# EAGLE board haasoscope_pro_adc_fpga_board (EAGLE 9.6.2), part 1 of 4
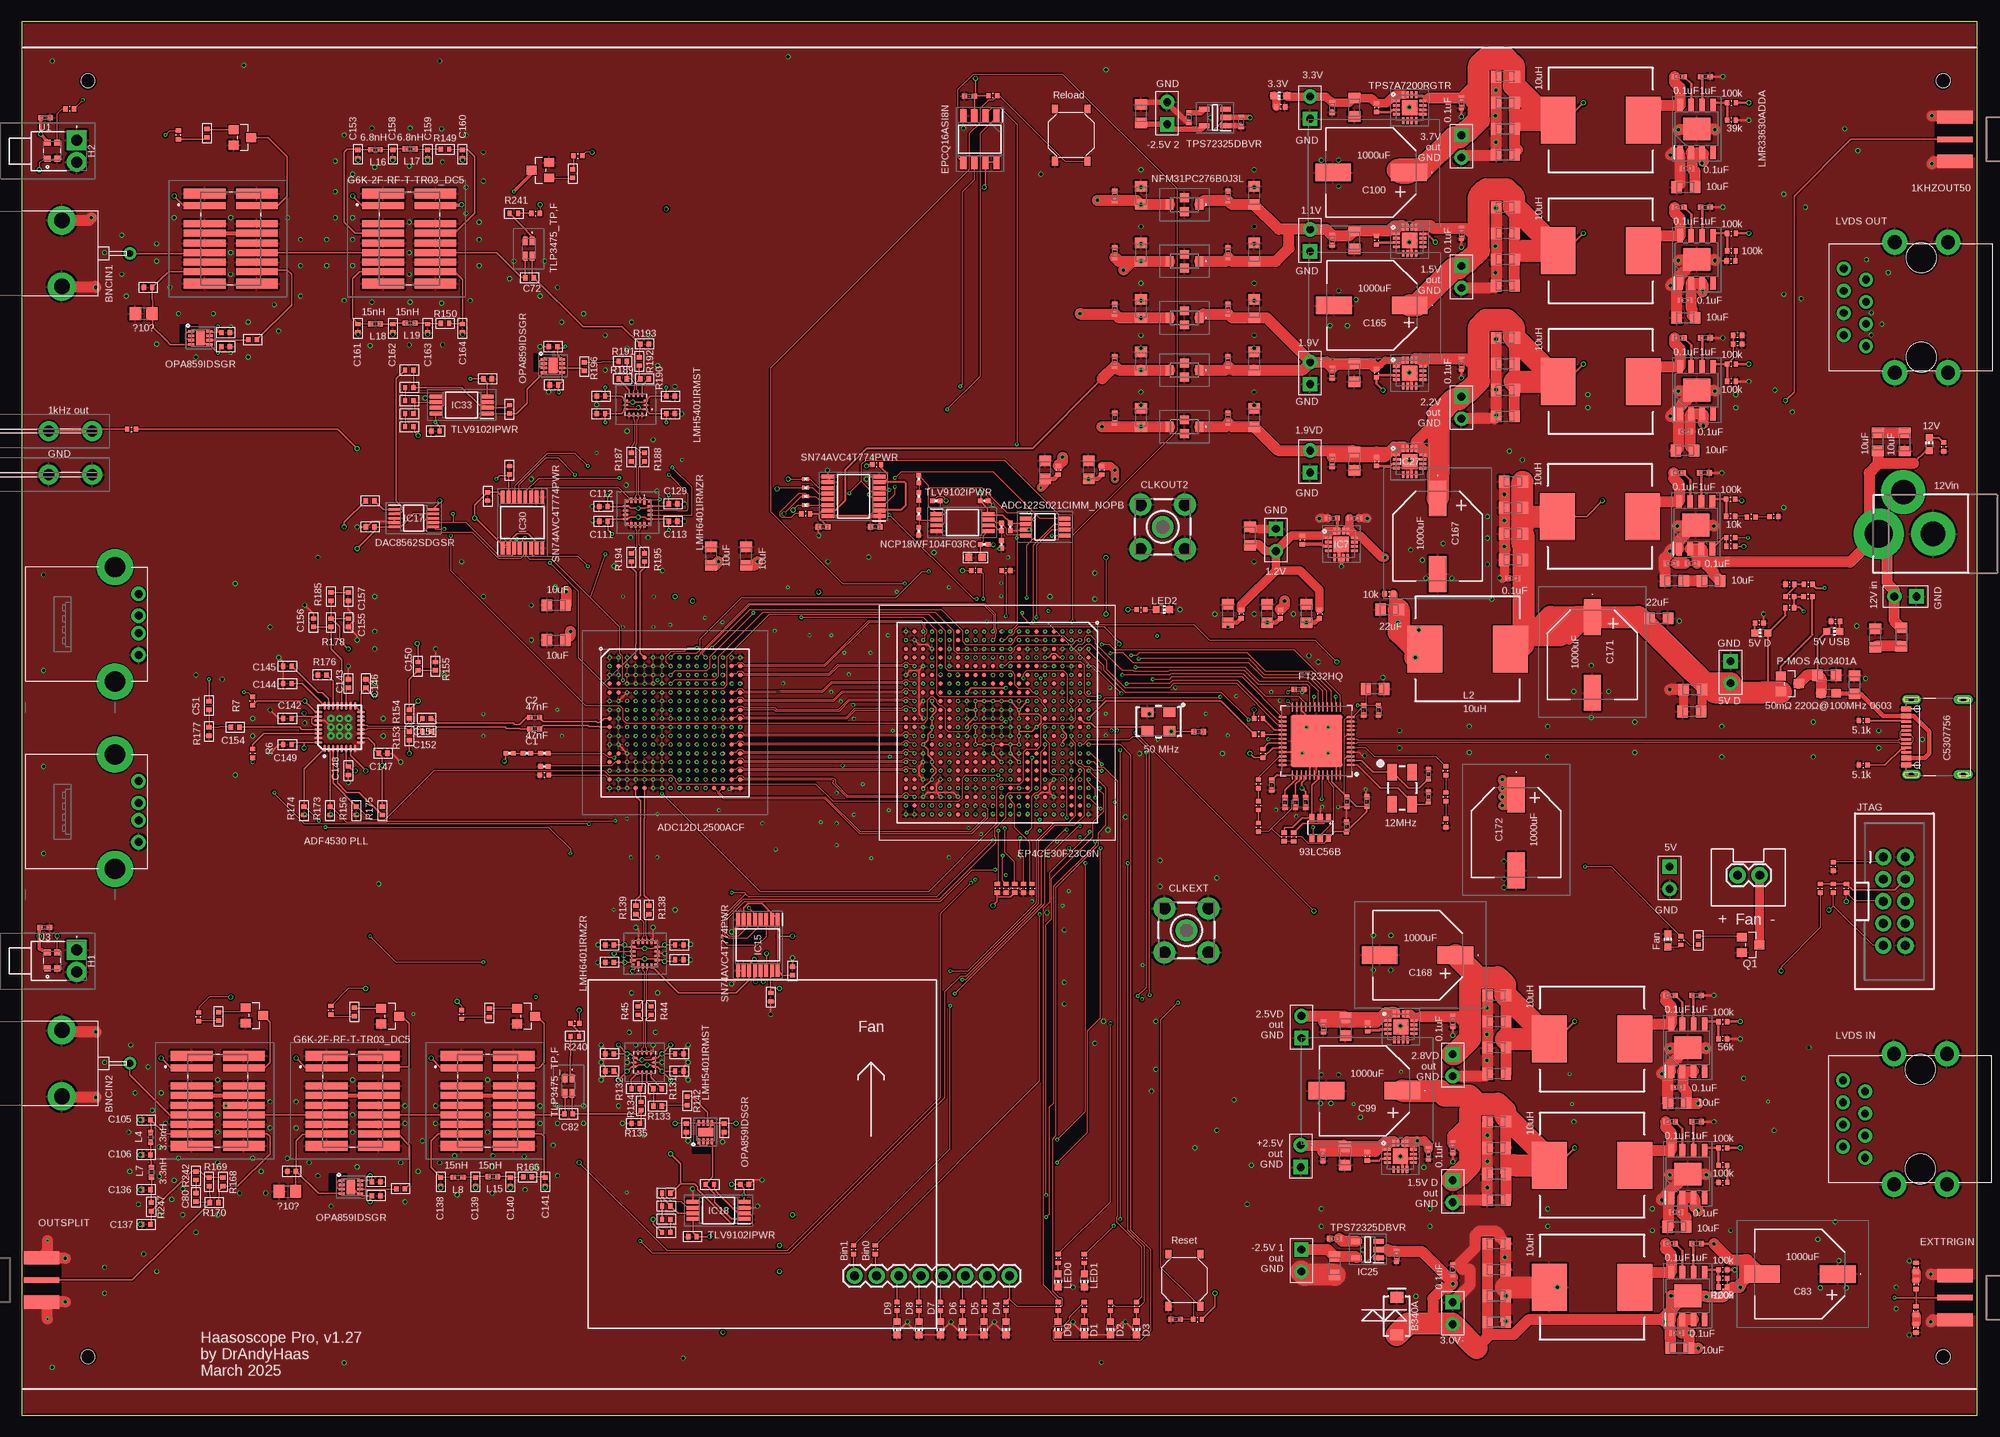
[diagram p16: board, top side]
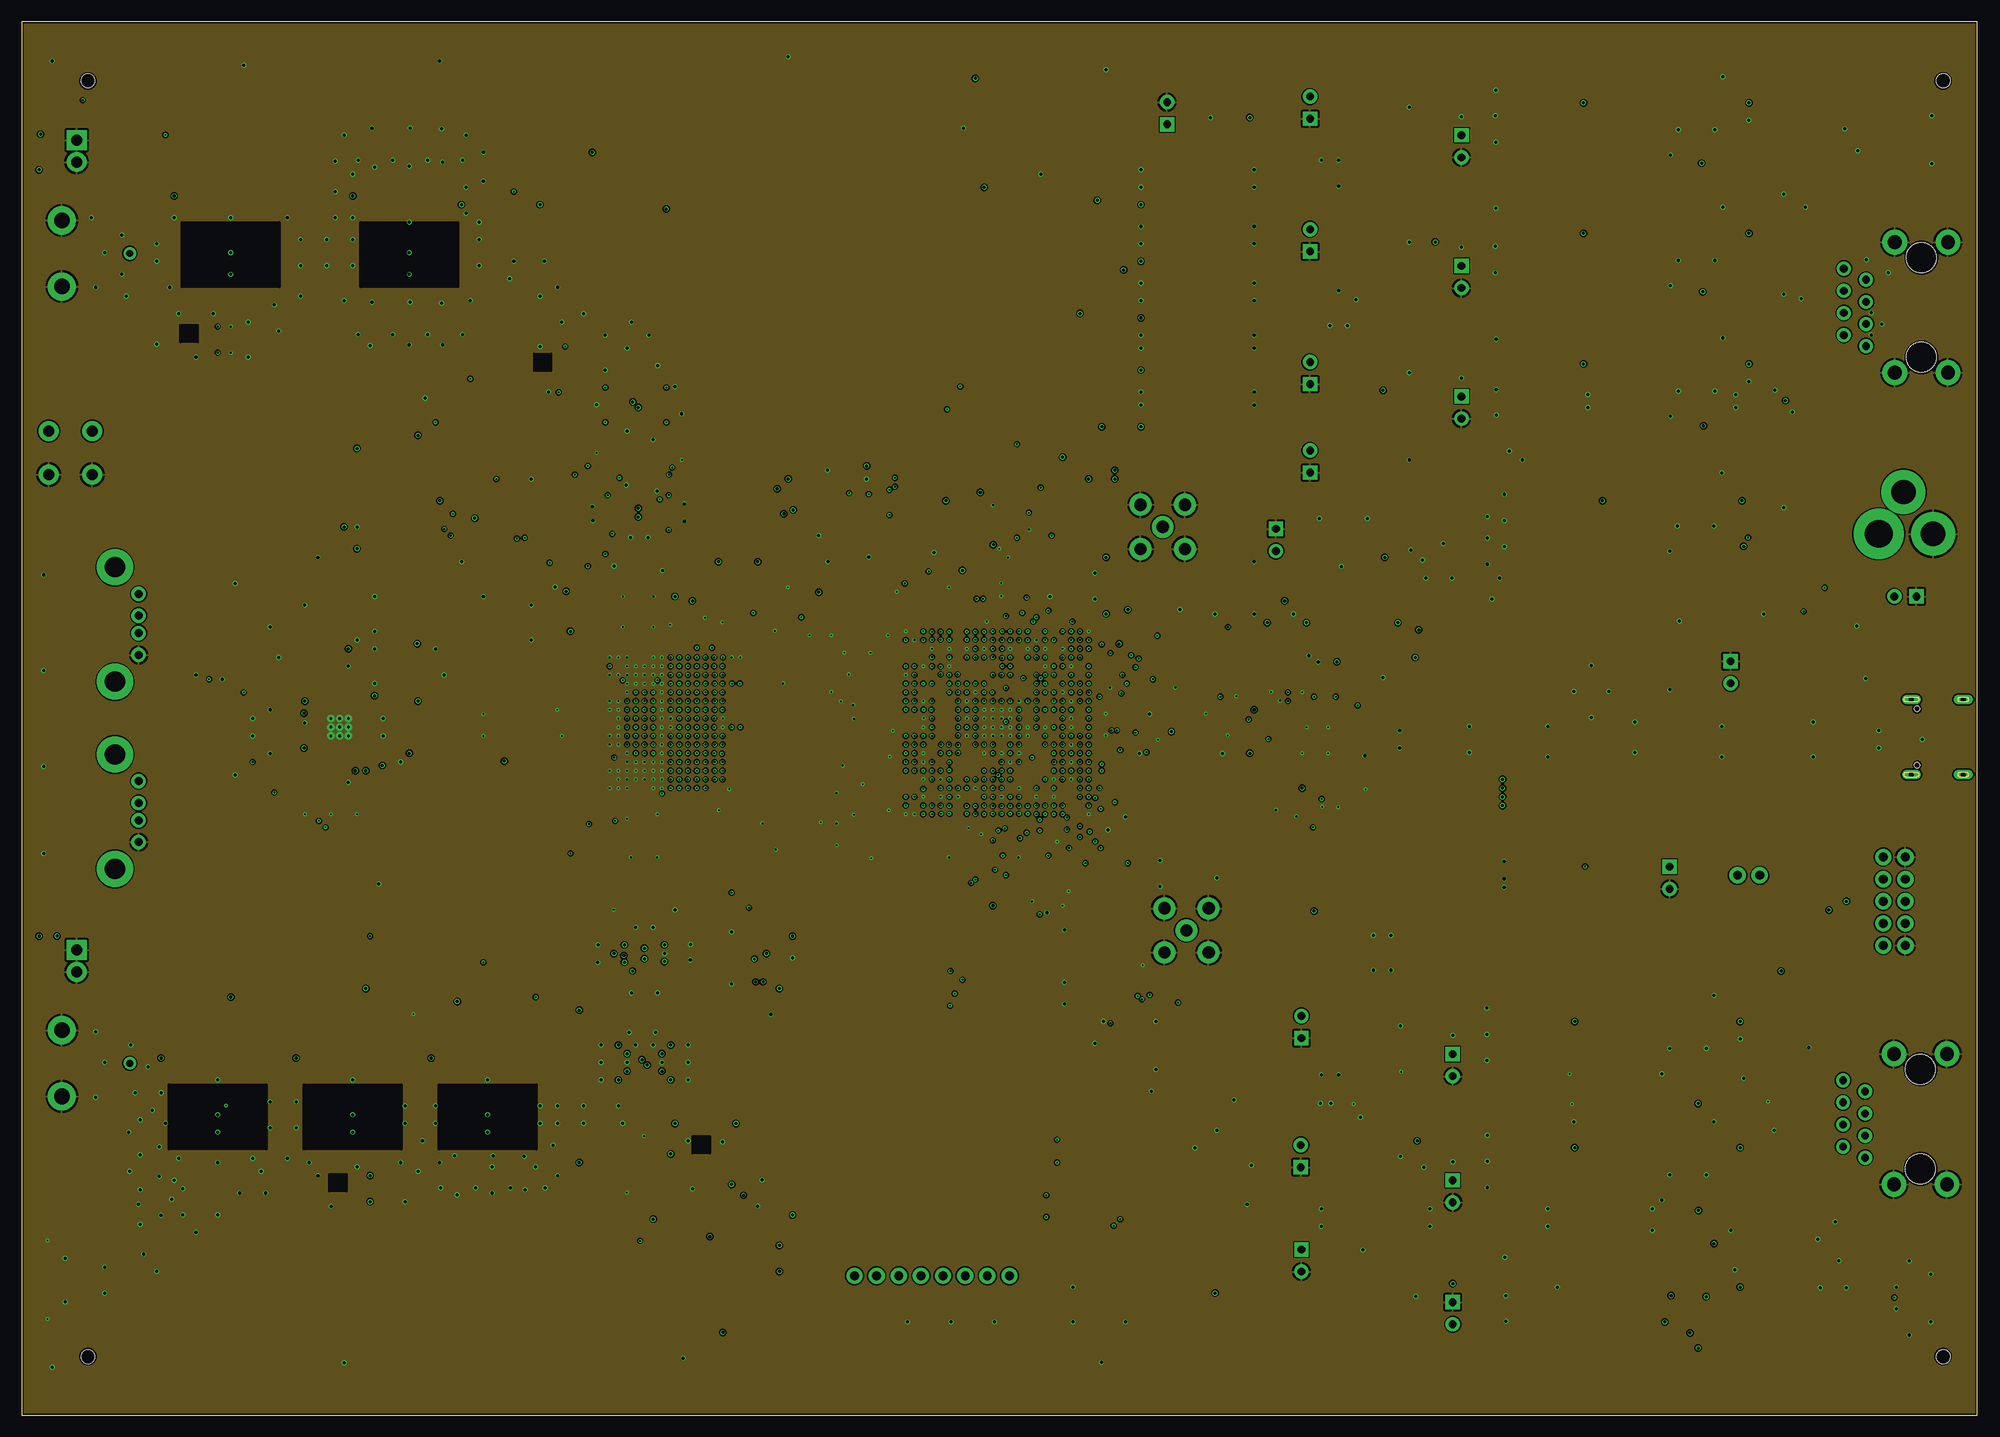
[diagram p17: board, inner layer topgnd]
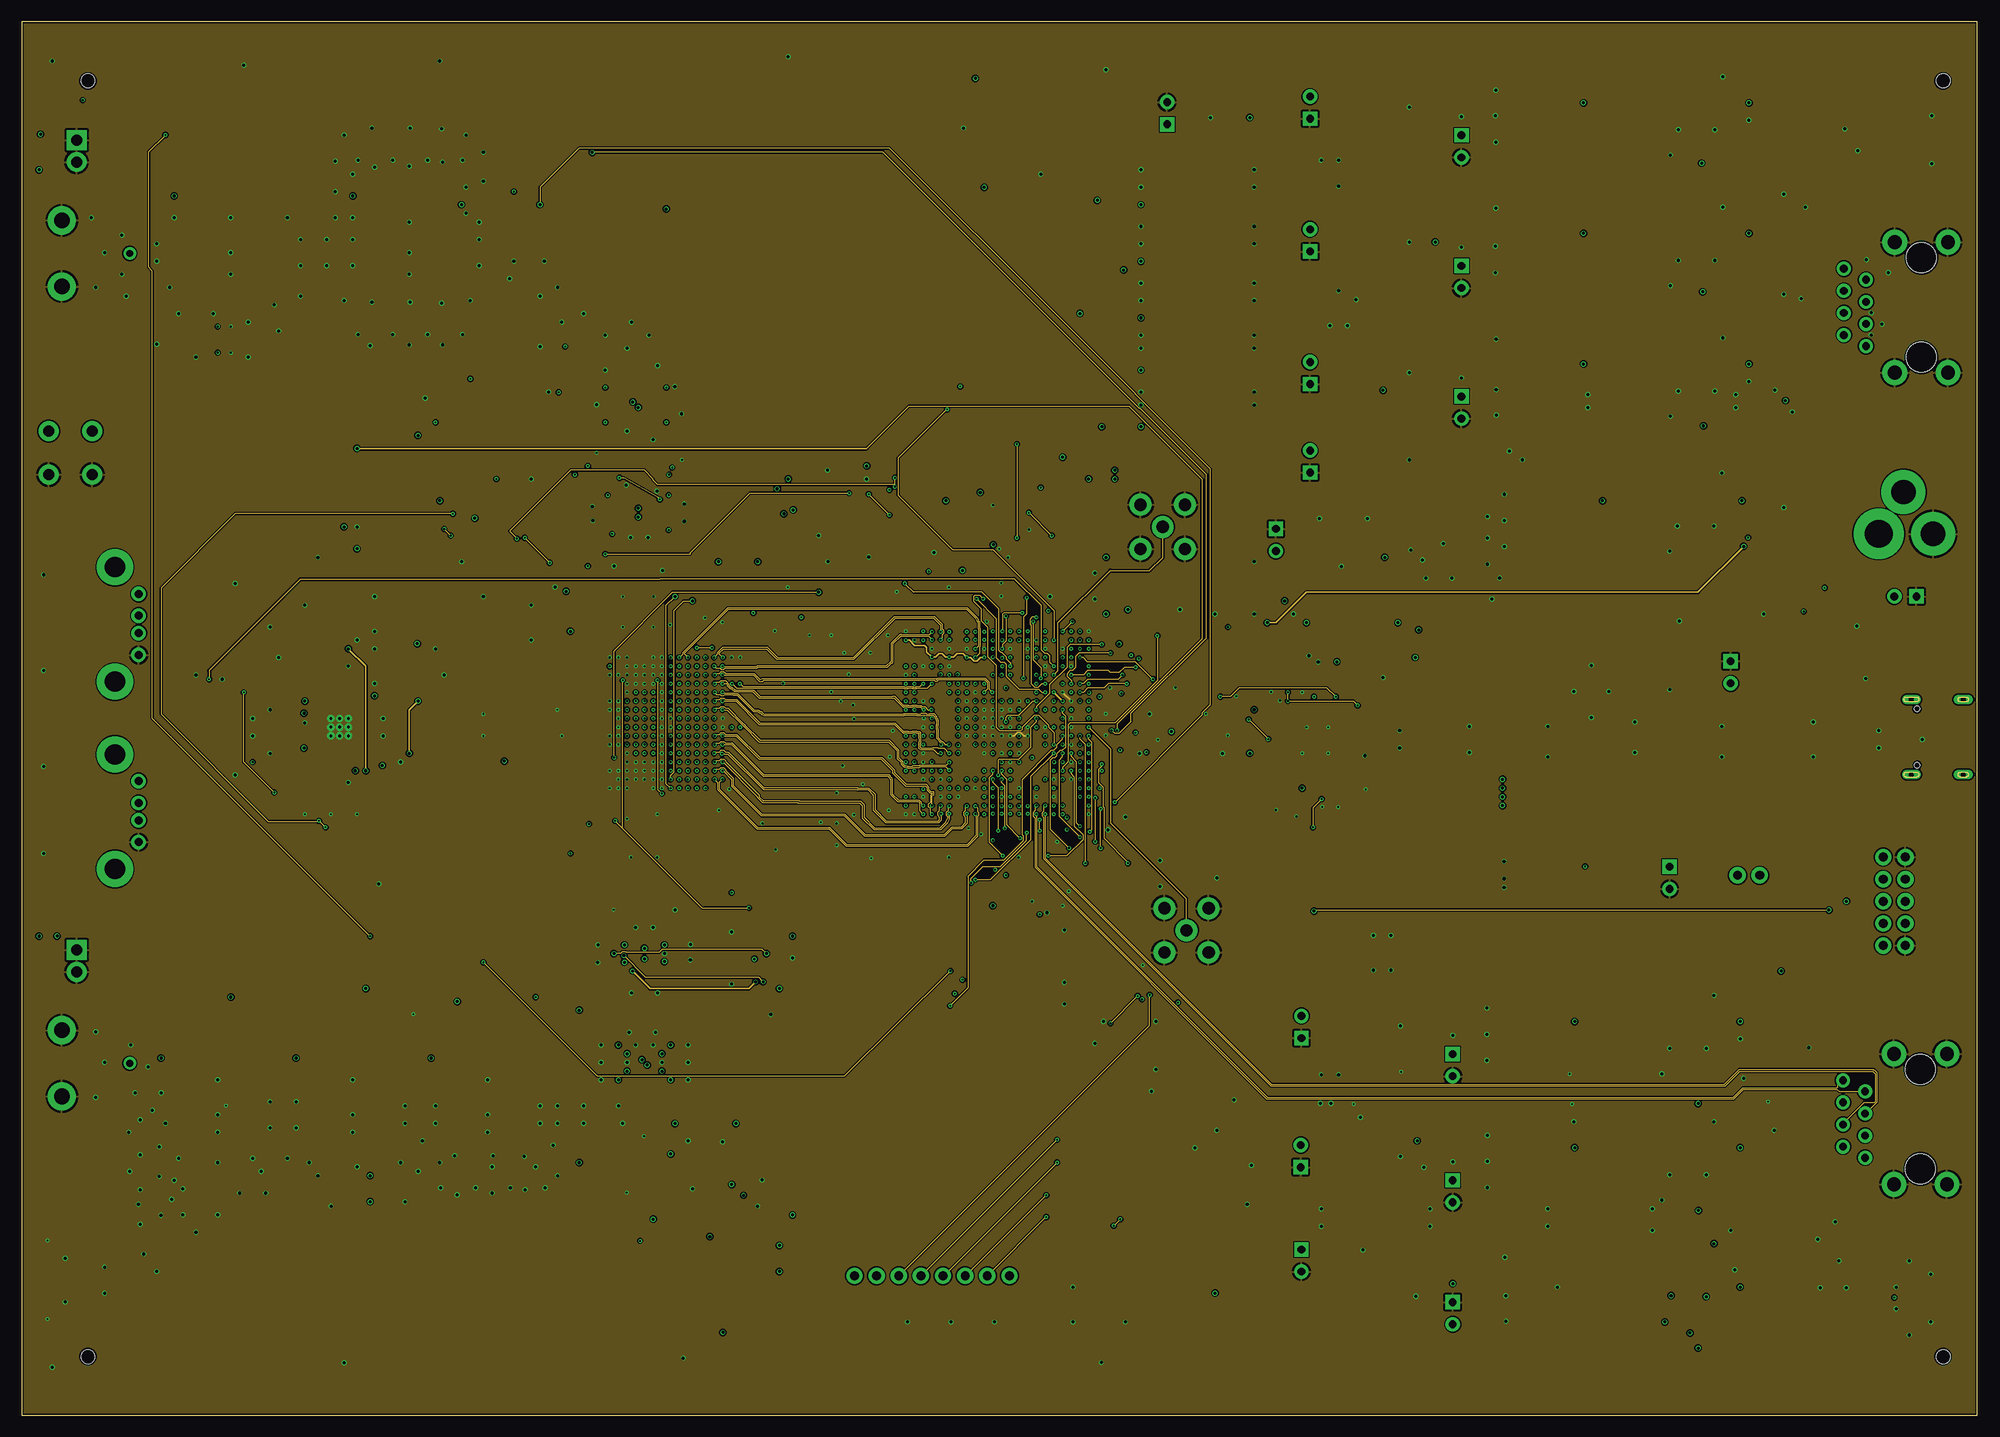
[diagram p18: board, inner layer sig2]
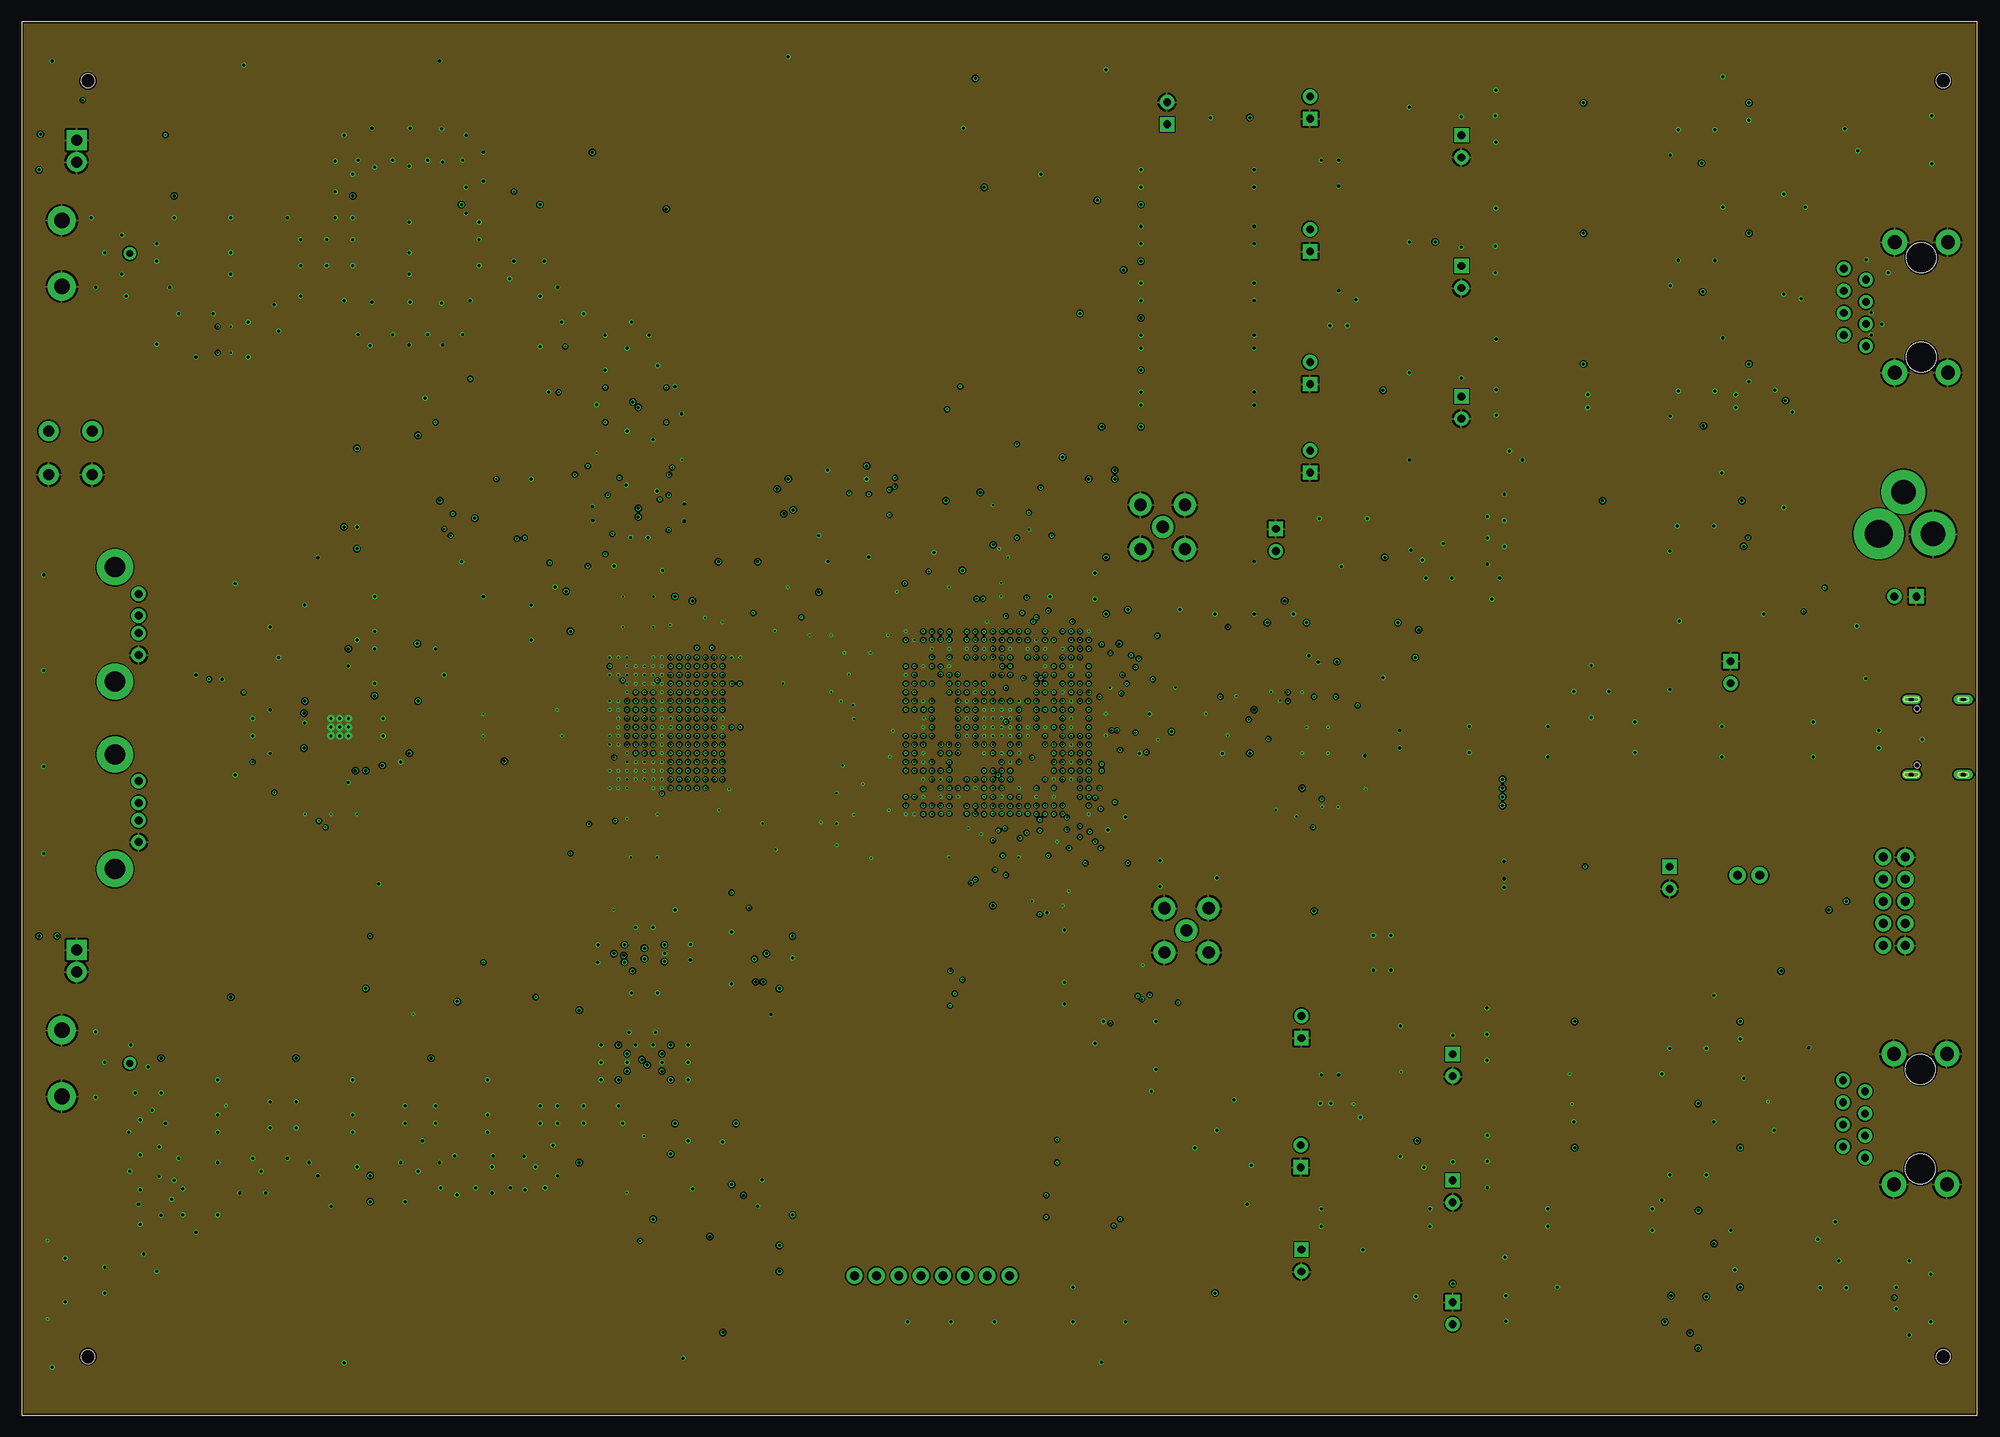
[diagram p19: board, inner layer sig2gnd]
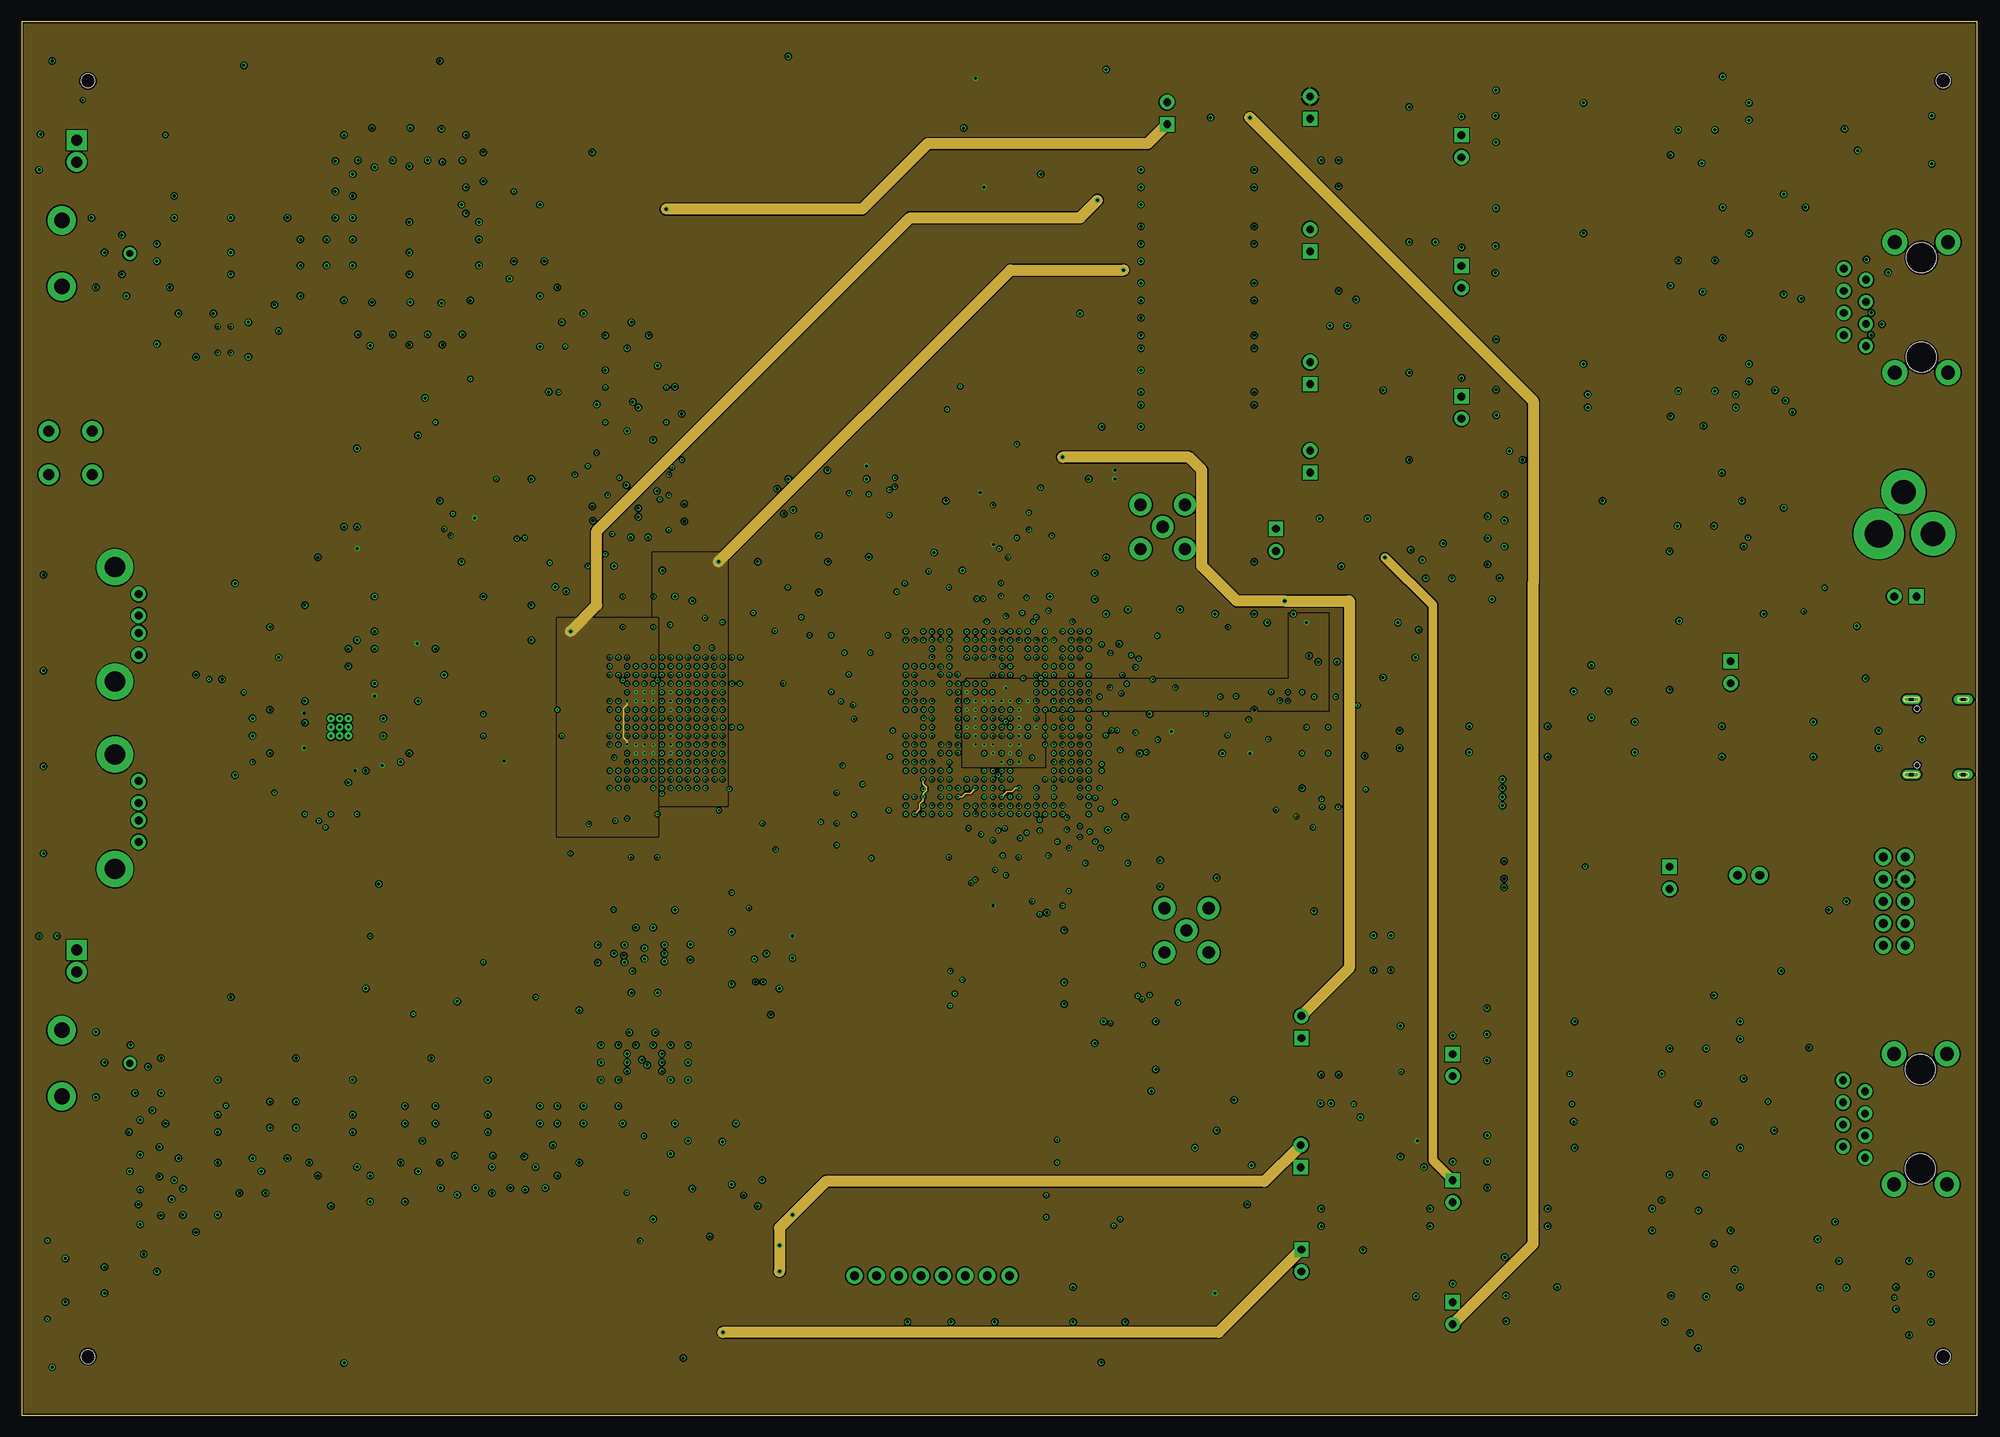
[diagram p20: board, inner layer pow1]
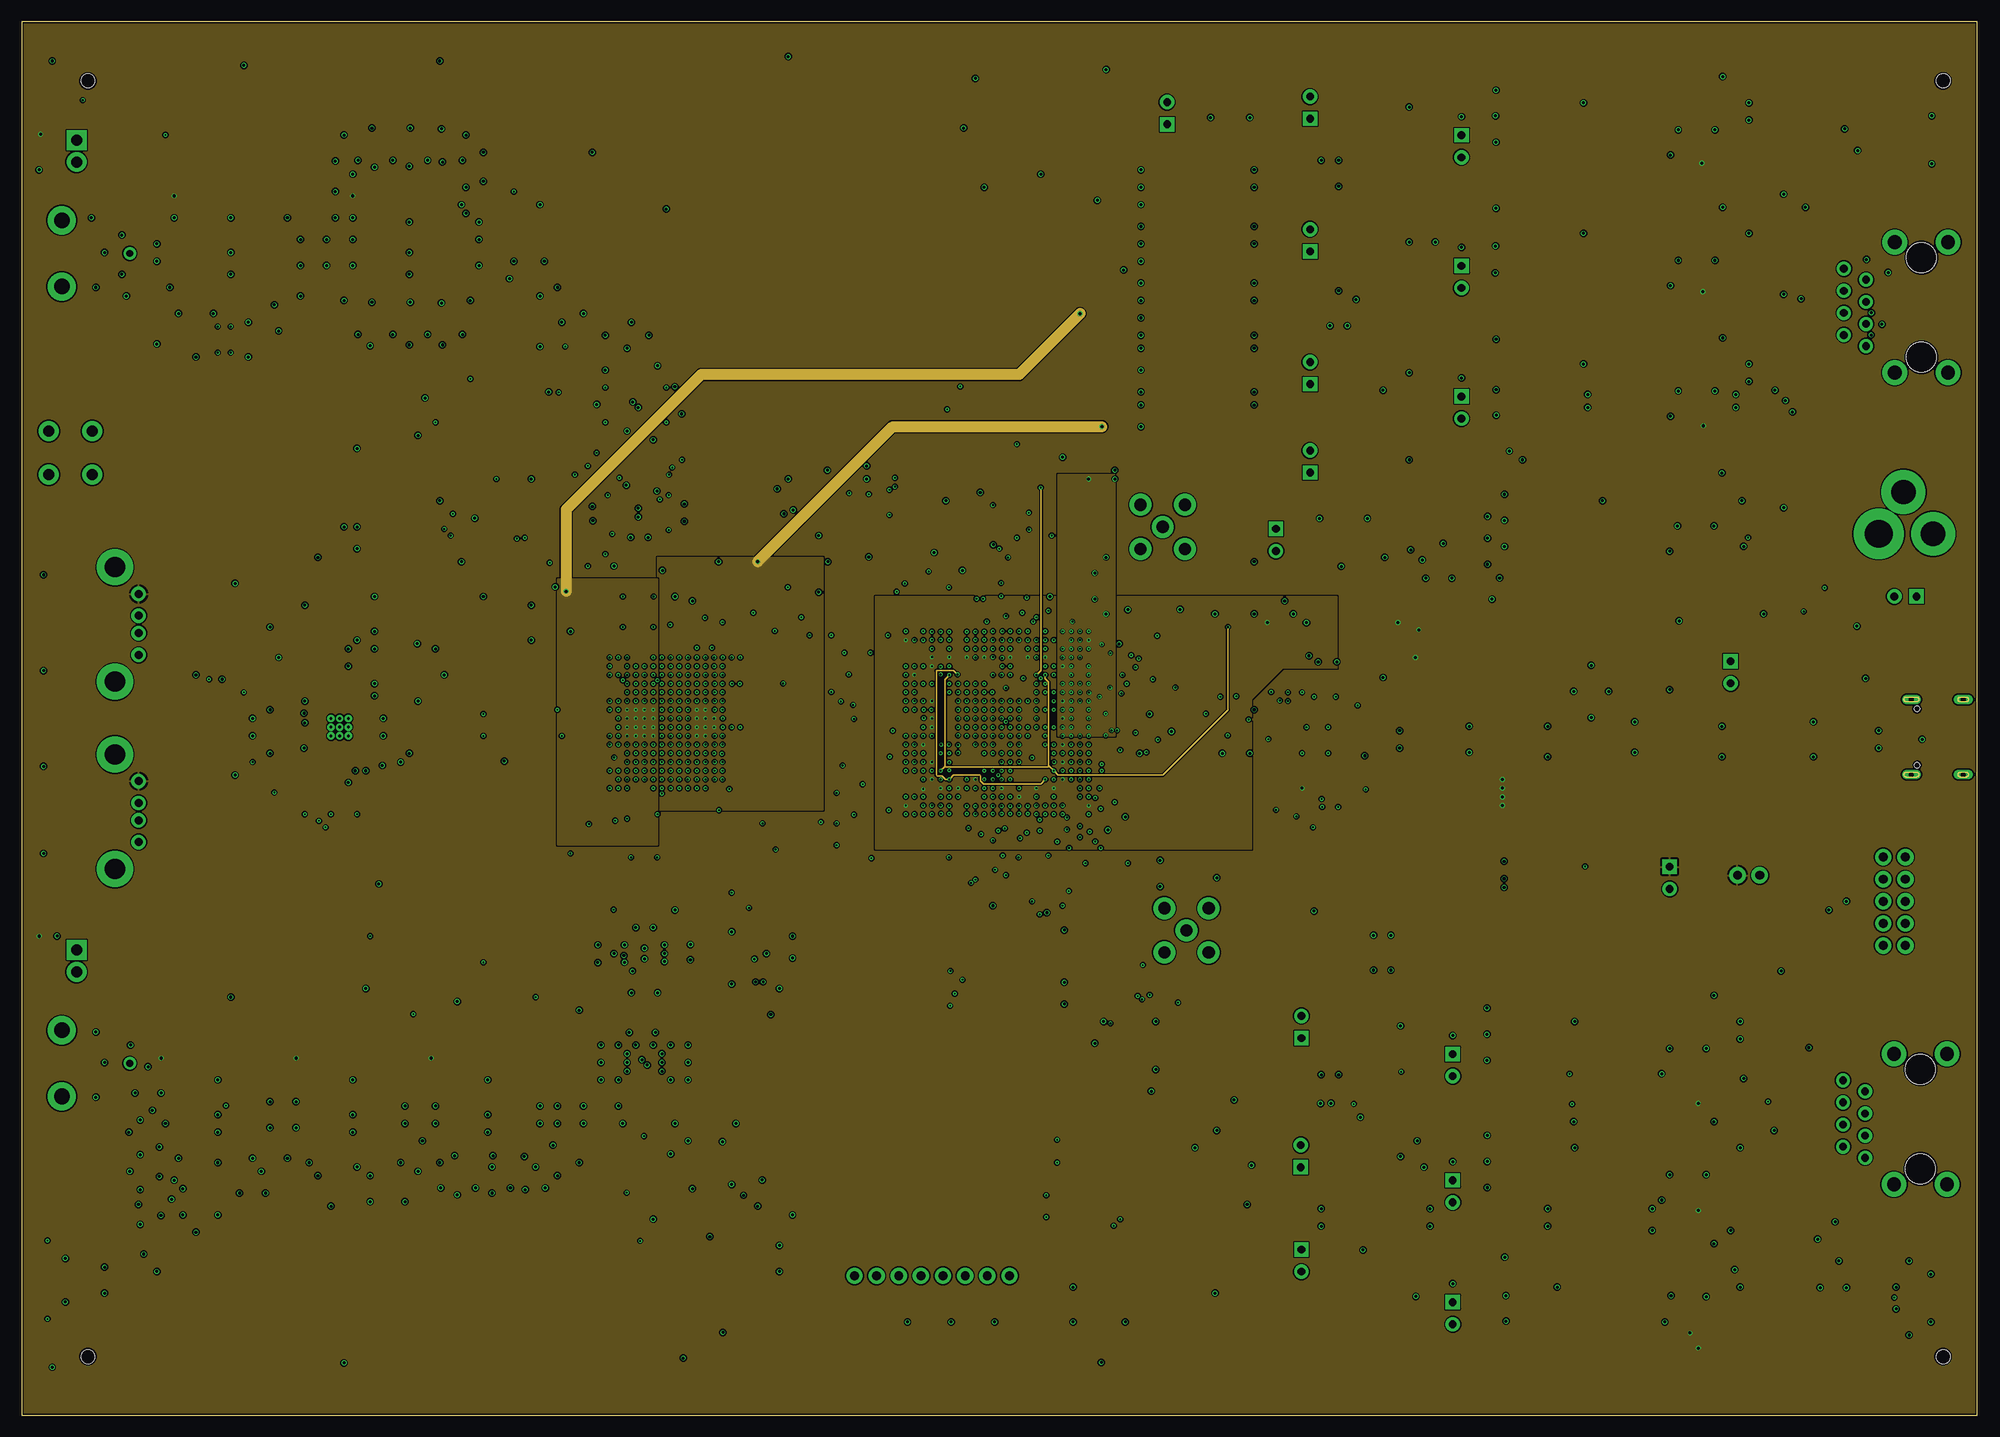
[diagram p21: board, inner layer pow2]
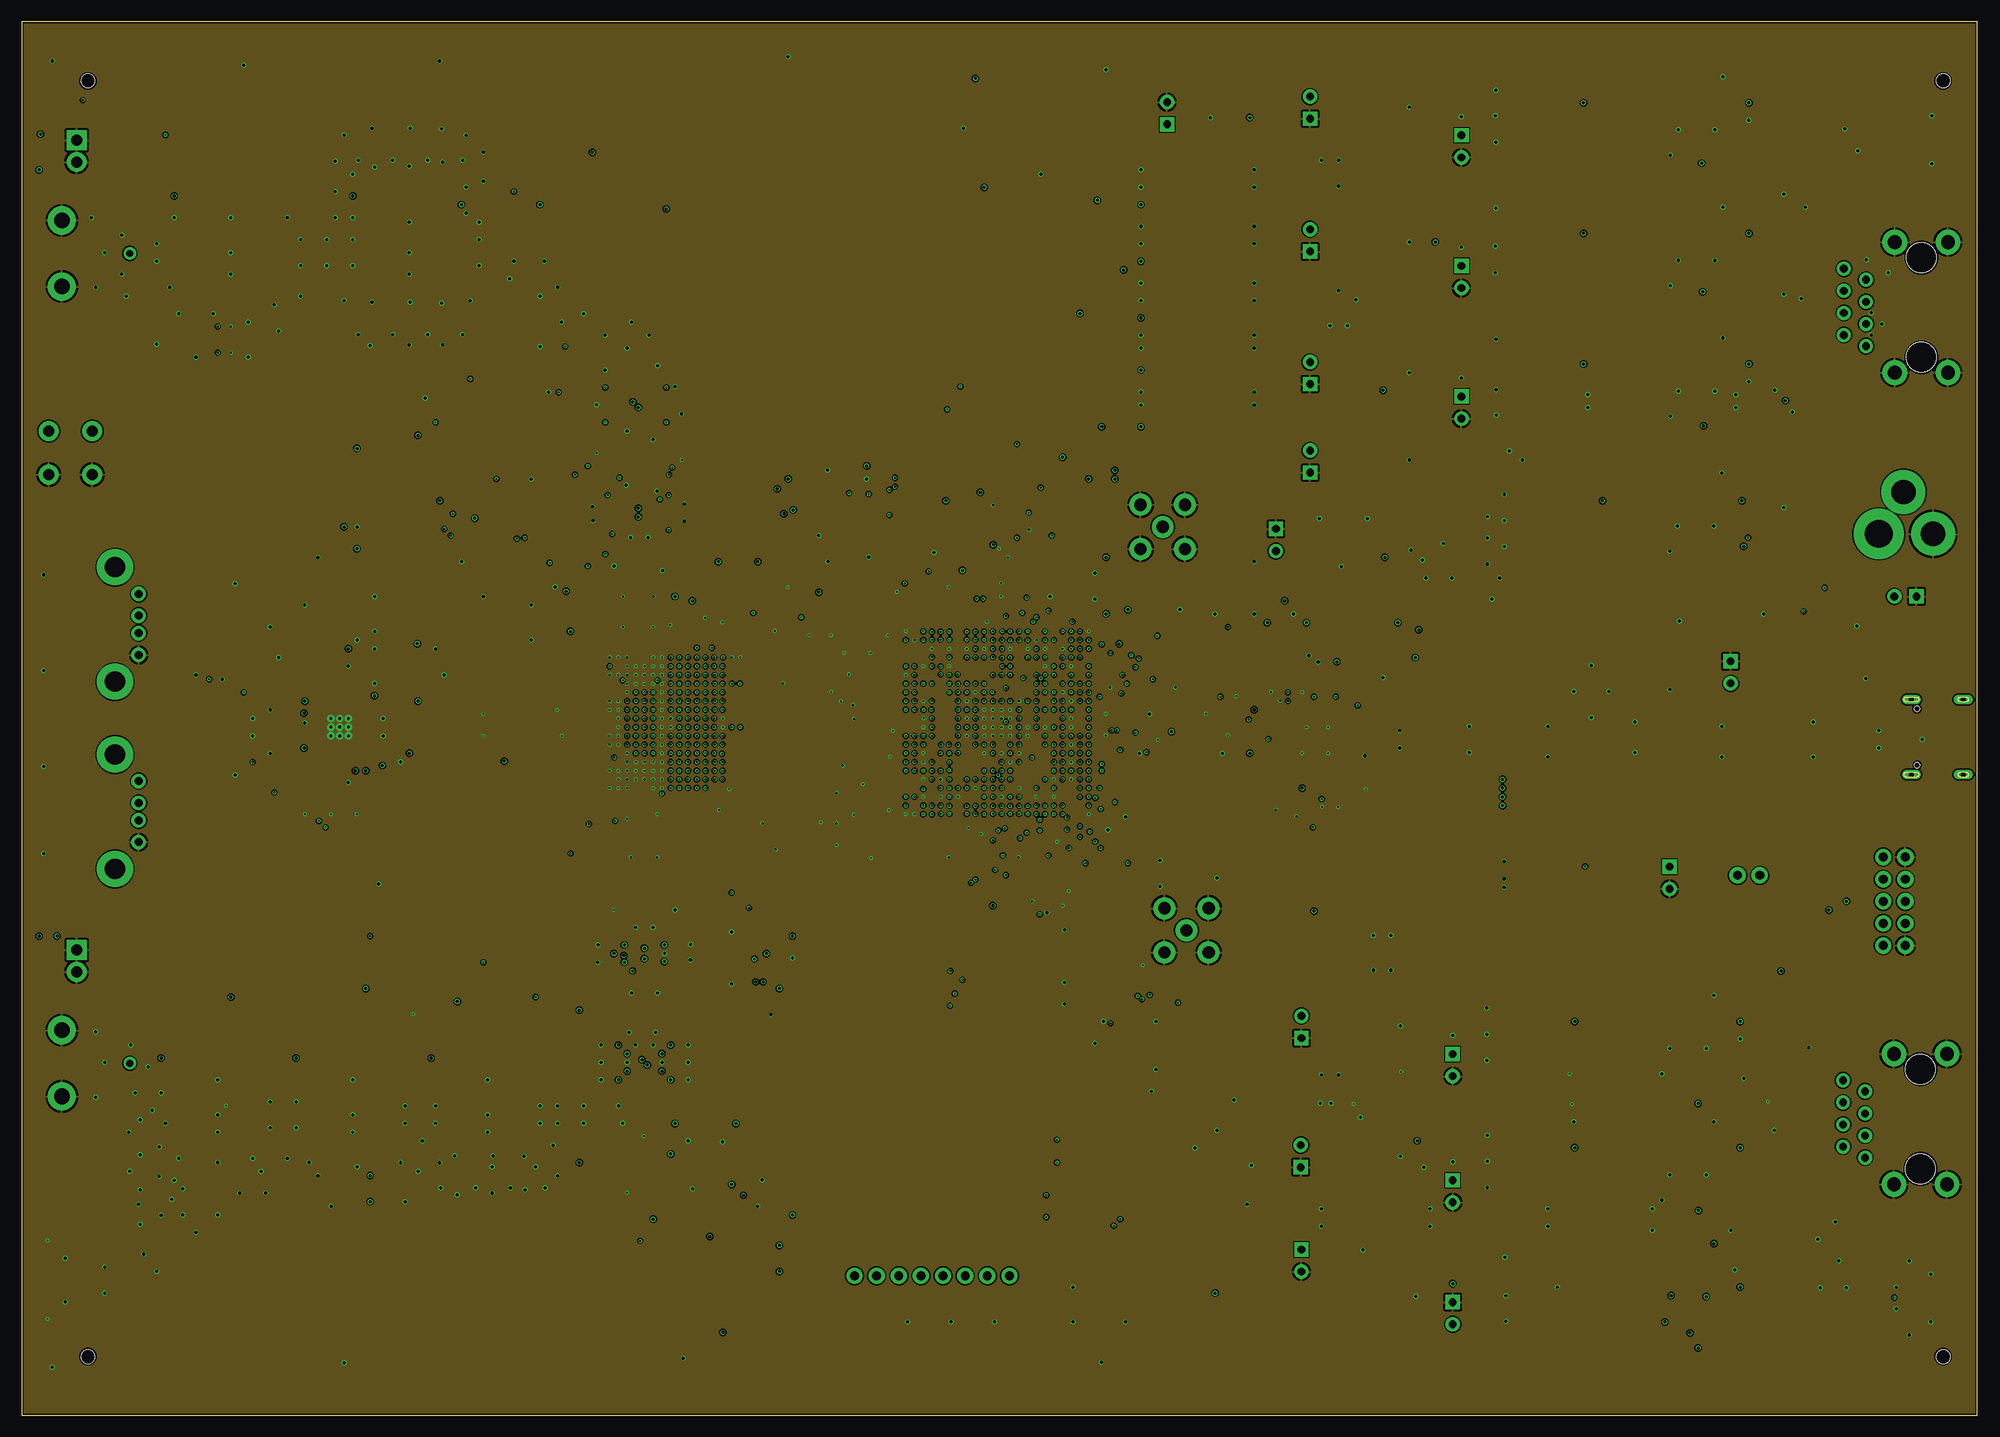
[diagram p22: board, inner layer sig4gnd]
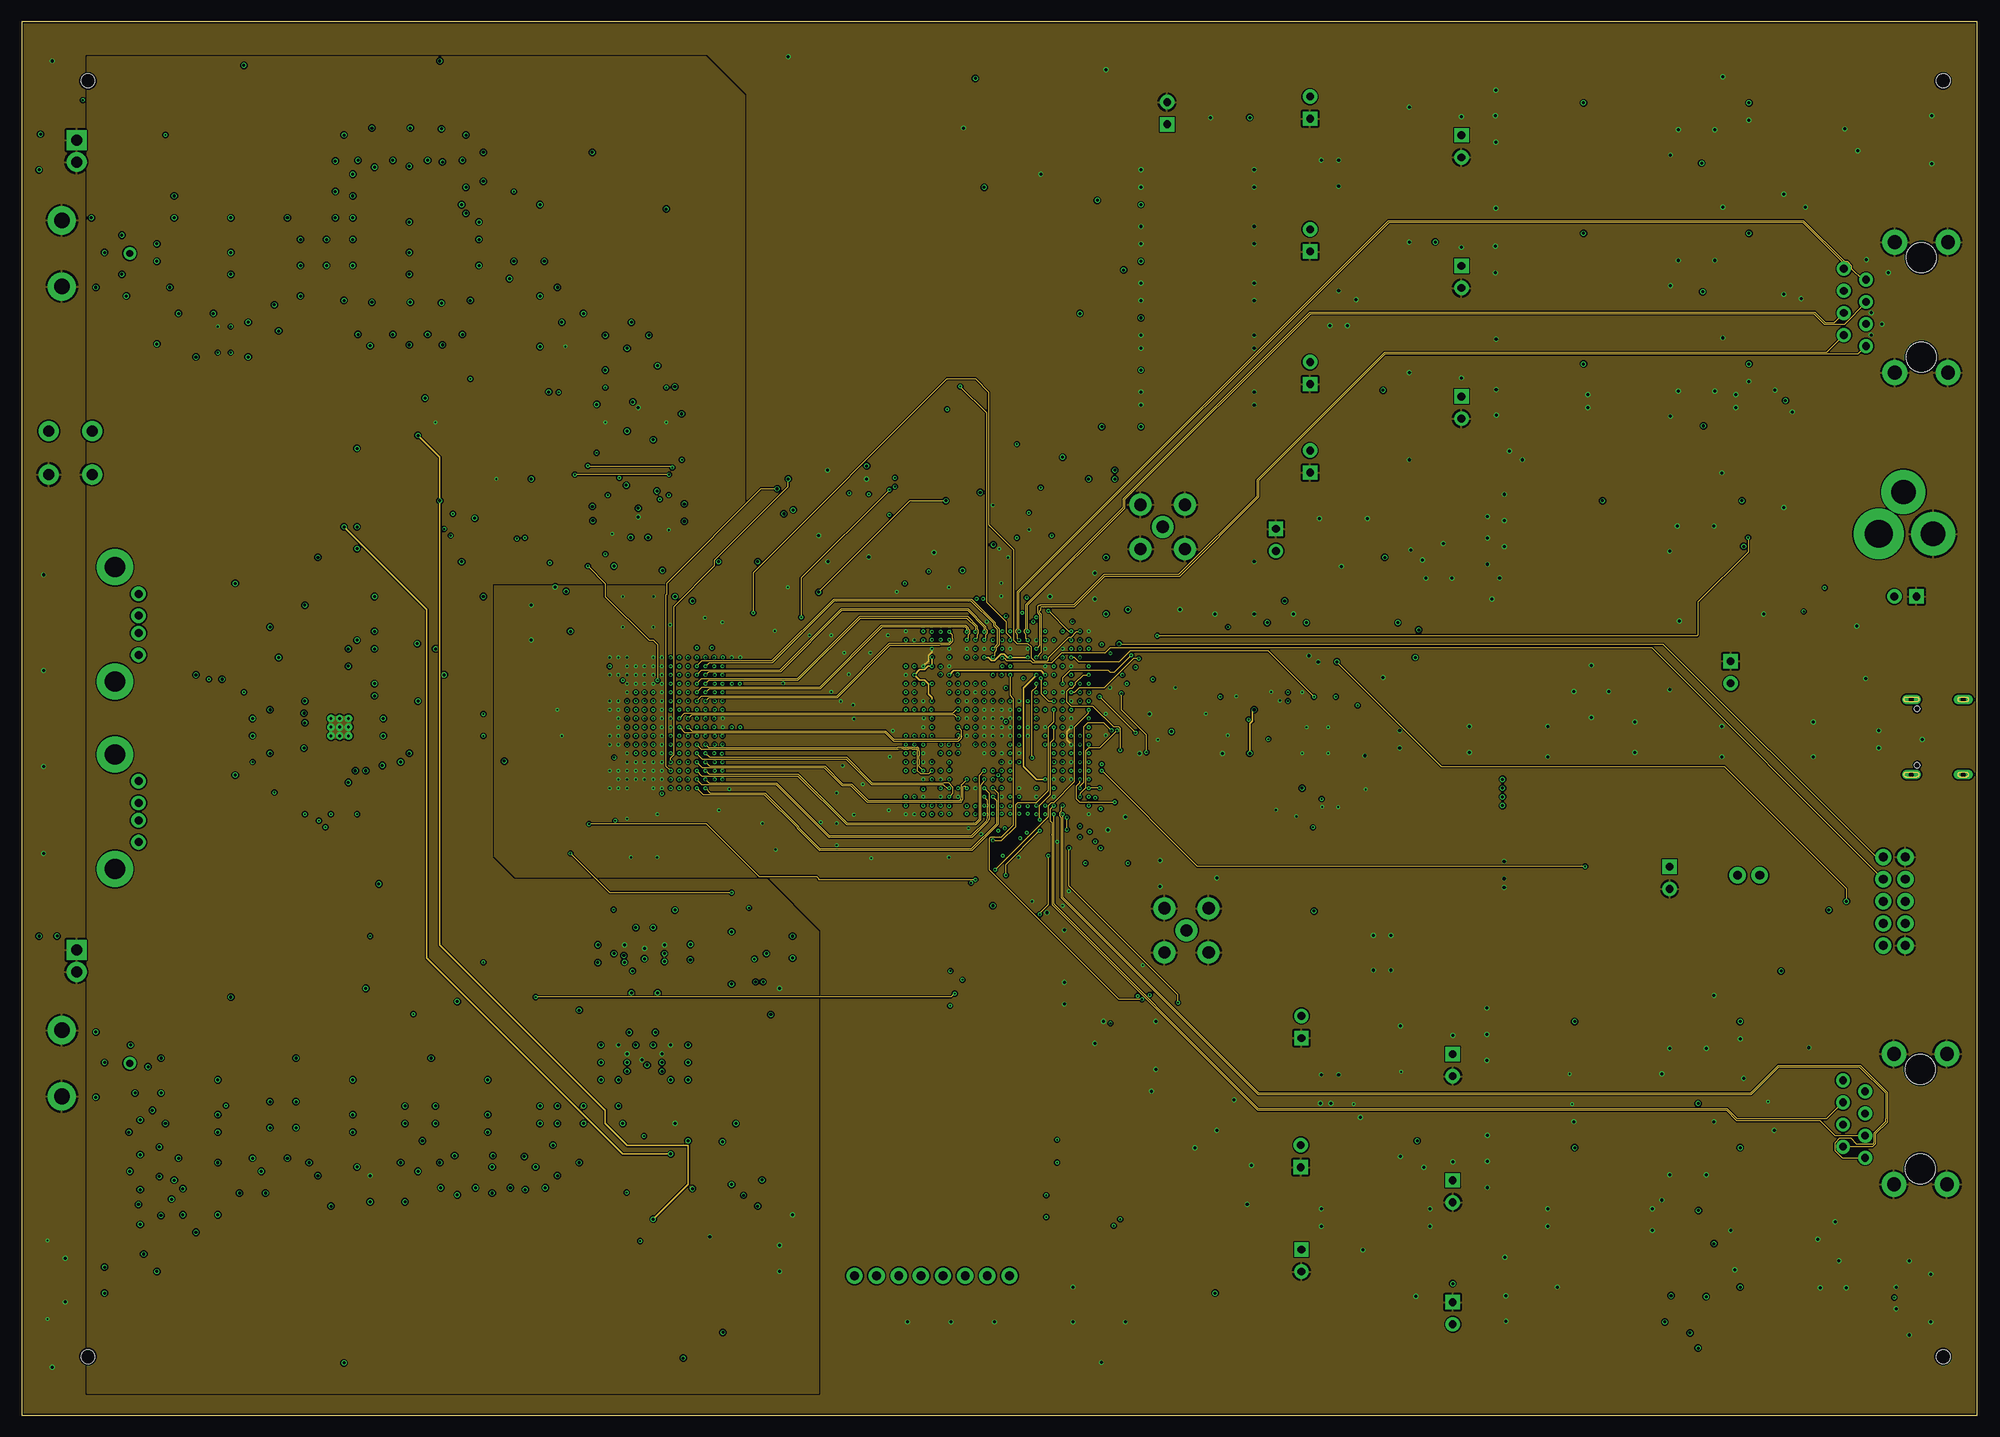
[diagram p23: board, inner layer sig4]
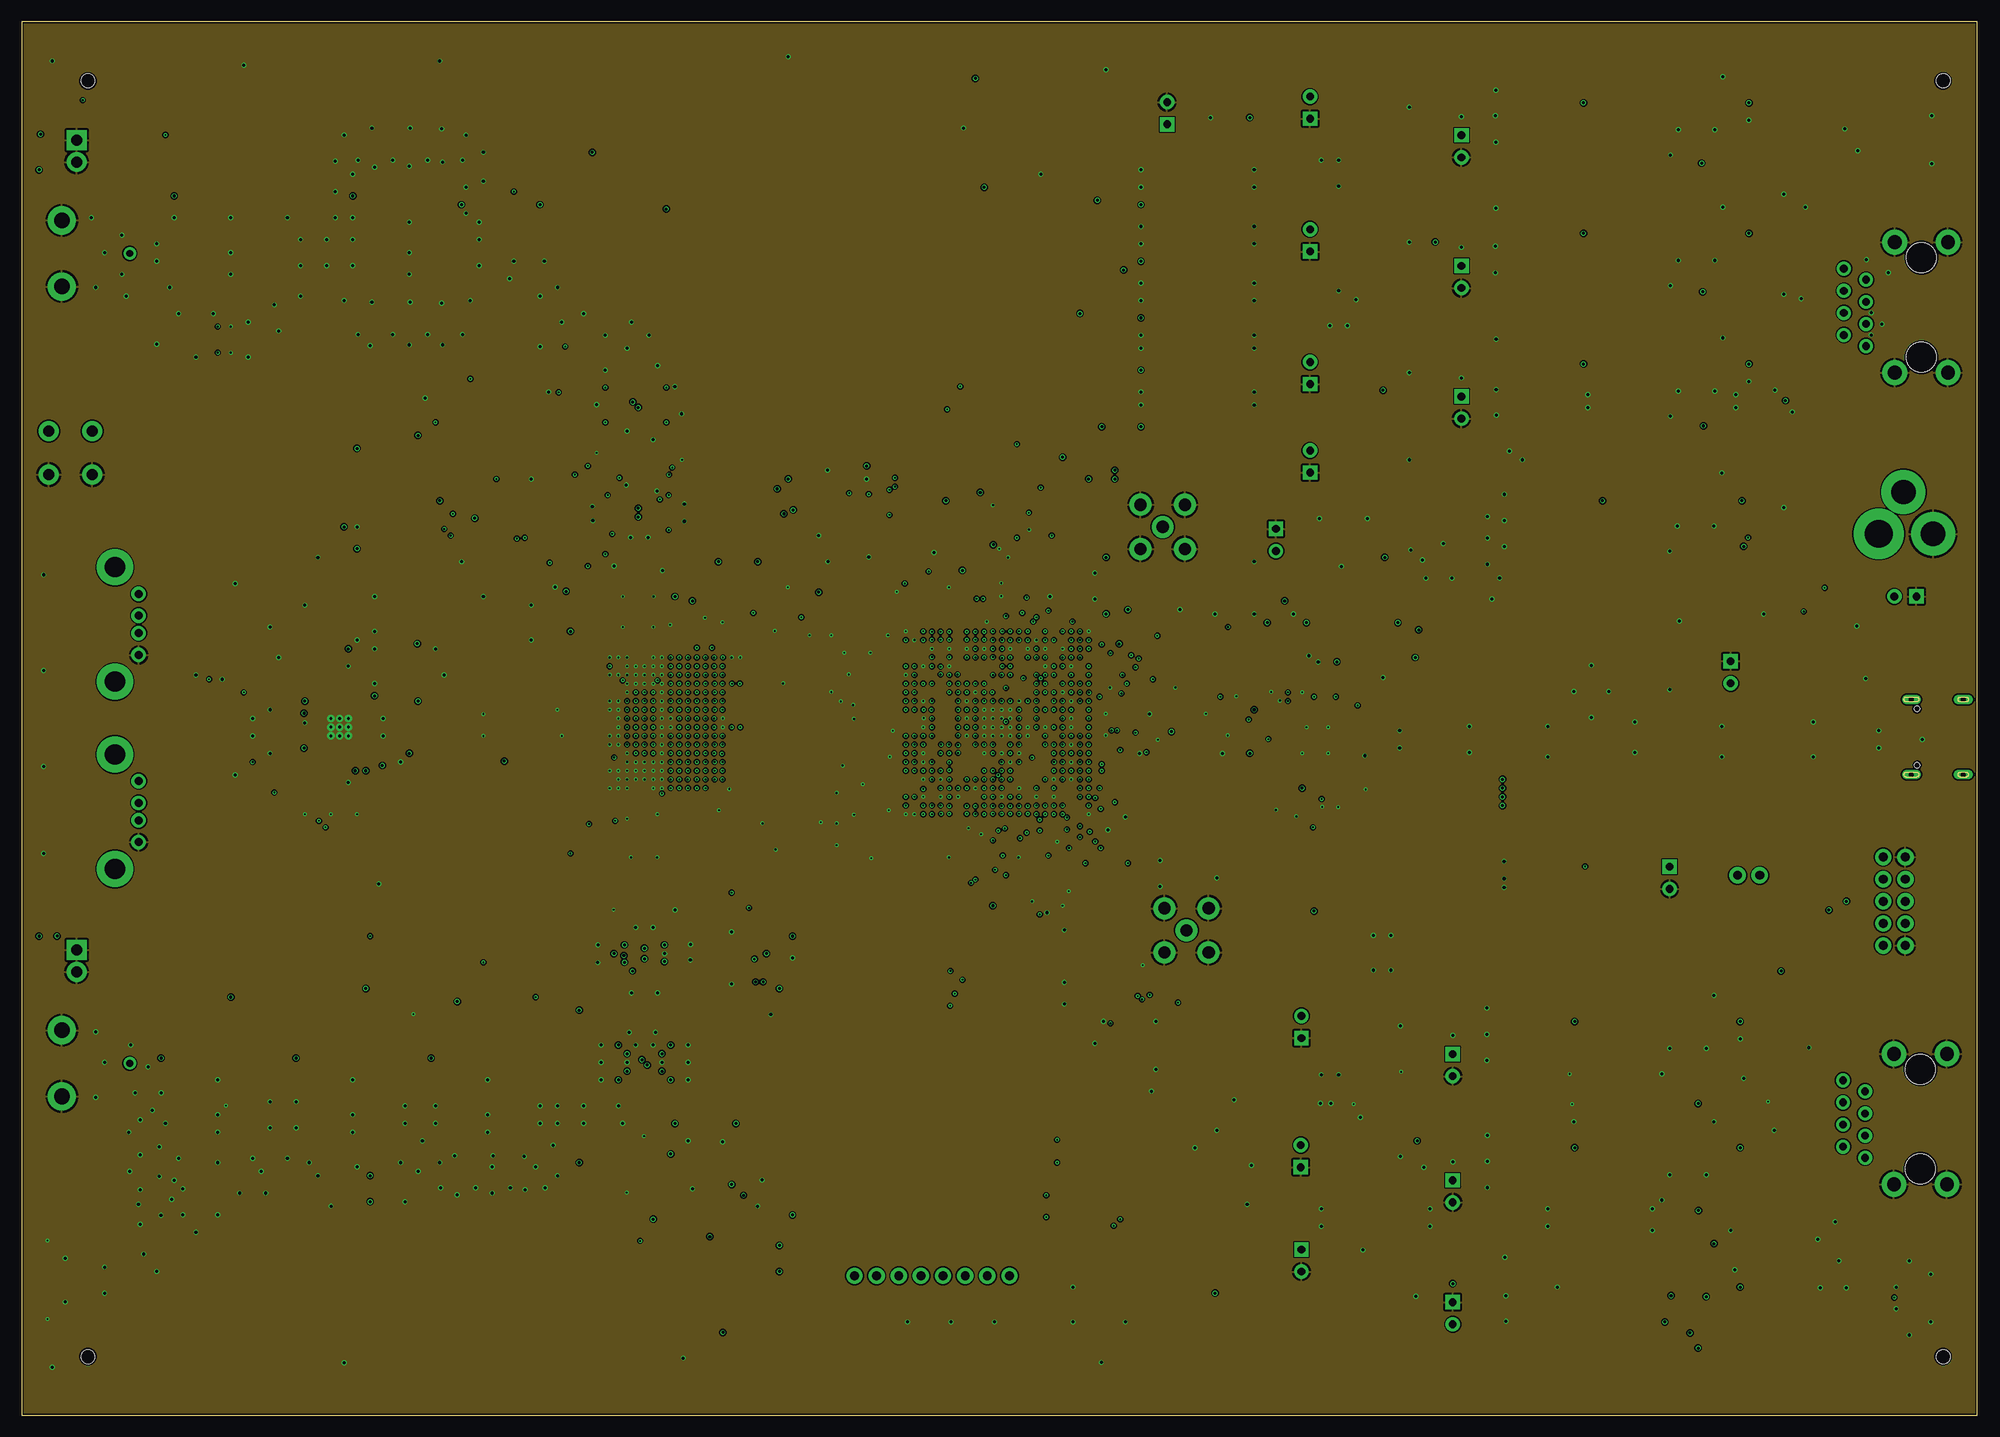
[diagram p24: board, inner layer sig5gnd]
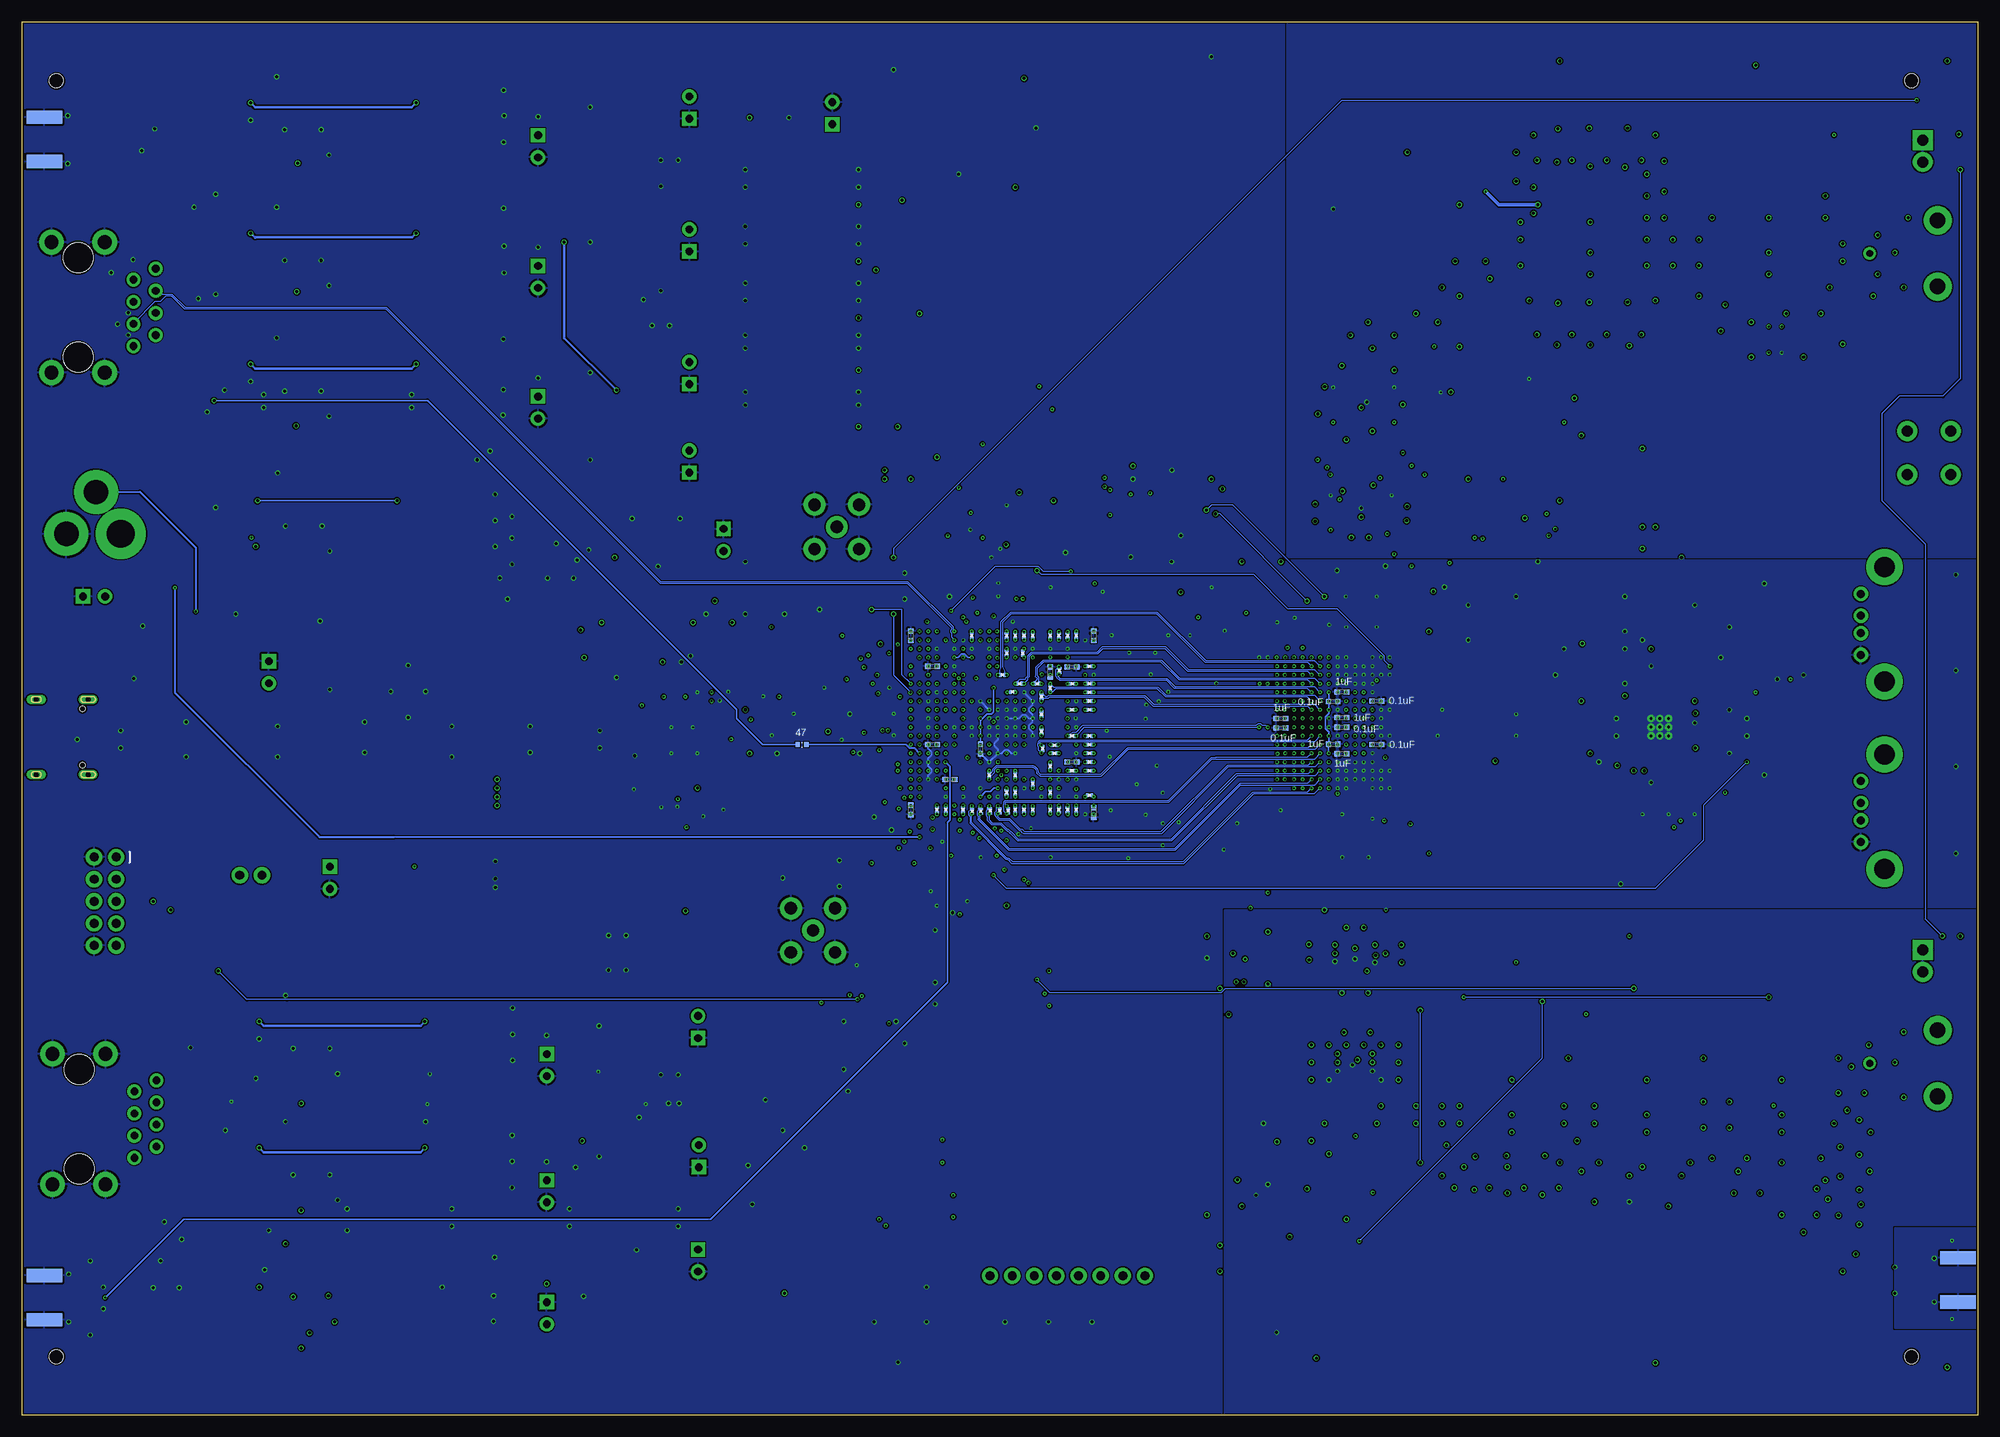
[diagram p25: board, bottom side, seen from below]

Size 224.5 x 160 mm. Coordinates in mm from the lower left corner, seen from the top.
Outline: 0,160 0,0 224.5,0 224.5,160 0,160
Copper layers (1+2*3+4*5+12*13+14*15+16): top 0.035mm / dielectric 0.2mm / topgnd 0.0175mm / dielectric 0.15mm / sig2 0.035mm / dielectric 0.2mm / sig2gnd 0.035mm / dielectric 0.15mm / pow1 0.035mm / dielectric 0.2mm / pow2 0.035mm / dielectric 0.15mm / sig4gnd 0.035mm / dielectric 0.2mm / sig4 0.035mm / dielectric 0.15mm / sig5gnd 0.0175mm / dielectric 0.2mm / sig5 0.035mm
Design rules "jlcpcb-10layers-haas *": minimum track width 3.5mil, minimum drill 0.2mm, track to track 3.5mil, track to pad 5mil, pad to pad 5mil, via to via 7mil, smd to smd 0mil, copper to edge 0.2mm, drill to drill 6mil, minimum pad ring 10mil, minimum via ring 0.1mm, stop-mask expansion 0.05mm, vias tented up to drill 16mil, thermal gap 10mil
Net classes: 0 default: width 0.089 mm; 1 power: width 0.152 mm; 2 diffpair: width 0.089 mm; 3 loosediffpair: width 0.102 mm, clearance 0.127 mm to class 0, clearance 0.127 mm to class 1, clearance 0.127 mm to class 2, clearance 0.127 mm; 5 critical: width 0.12 mm, clearance 0.15 mm to class 0, clearance 0.15 mm to class 1, clearance 0.15 mm to class 2, clearance 0.15 mm to class 3, clearance 0.15 mm to class 4, clearance 0.15 mm; 6 looserdiffpair: width 0.152 mm, clearance 0.305 mm to class 0, clearance 0.305 mm to class 1, clearance 0.305 mm to class 2, clearance 0.305 mm to class 3, clearance 0.305 mm to class 4, clearance 0.305 mm to class 5, clearance 0.305 mm
Holes 1.6 mm at 7.61,153.22 7.61,6.72 220.61,6.72 220.61,153.22

## Footprints (pad centres in the part's own frame; a part is rotated, then mirrored left to right if it is on the bottom)
SMA_EDGELAUNCH = smd 4.064 x 1.524: GND@1 2.032,-2.54; GND@2 2.032,2.54 | smd 4.064 x 1.524 bottom: GND@3 2.032,2.54; GND@4 2.032,-2.54 | smd 4.064 x 0.6: P 2.032,0
MOLEX-BNC-73100-0105 = drill 1.8: GND1 -3.8,-3.9; GND2 3.8,-3.9 | drill 0.8: SIGNAL 0,3.9
RESC0402_N = smd 0.6 x 0.6: 1 -0.55,0; 2 0.55,0
NFM31HK103R1H3L = smd 0.95 x 1.2: 1 -1.725,0; 3 1.725,0 | smd 1 x 1: 2 0,-0.8; 4 0,0.8
RESC0805_N = smd 1.2 x 1.35: 1 -1.1,0; 2 1,0
0402_CAP = smd 0.536 x 0.546: 1 -0.433,0; 2 0.433,0
C0402 = smd 0.5 x 0.6: P$1 -0.483,0; P$2 0.483,0
C0805 = smd 1.3 x 1.5: 1 -0.95,0; 2 0.95,0
EEE0JA152UAP = smd 4.1 x 2: 1 -4.35,0; 2 4.35,0
BU-SMB-V = drill 1.4: 1 0,0; 2 -2.54,2.54; 3 2.54,2.54; 4 2.54,-2.54; 5 -2.54,-2.54
DCJACK_2MM_PTH = drill 2.8: GND 0,7.35; GNDBREAK 4.8,10.75 | drill 3.2: PWR 0,13.6
SMA-DIODE = smd 1.27 x 1.47: A -2.15,0; C 2.15,0
0603 = smd 1.1 x 1: 1 -0.85,0; 2 0.85,0
SON50P200X200X80-9N = smd 0.7 x 0.3: 1 -1.05,0.75; 2 -1.05,0.25; 3 -1.05,-0.25; 4 -1.05,-0.75; 5 1.05,-0.75; 6 1.05,-0.25; 7 1.05,0.25; 8 1.05,0.75 | smd 1 x 1.7: 9 0,0
SLP3150100F = drill 1.27 pad 1.905 square: 1 0,0 | drill 1.27 pad 1.905: 2 2.5,0
BGA256C100P16X16_1700X1700X331 = smd 0.53 x 0.53: A1 -7.5,7.5; A2 -6.5,7.5; A3 -5.5,7.5; A4 -4.5,7.5; A5 -3.5,7.5; A6 -2.5,7.5; A7 -1.5,7.5; A8 -0.5,7.5; A9 0.5,7.5; A10 1.5,7.5; A11 2.5,7.5; A12 3.5,7.5; A13 4.5,7.5; A14 5.5,7.5; A15 6.5,7.5; A16 7.5,7.5; B1 -7.5,6.5; B2 -6.5,6.5; B3 -5.5,6.5; B4 -4.5,6.5; B5 -3.5,6.5; B6 -2.5,6.5; B7 -1.5,6.5; B8 -0.5,6.5; B9 0.5,6.5; B10 1.5,6.5; B11 2.5,6.5; B12 3.5,6.5; B13 4.5,6.5; B14 5.5,6.5; B15 6.5,6.5; B16 7.5,6.5; C1 -7.5,5.5; C2 -6.5,5.5; C3 -5.5,5.5; C4 -4.5,5.5; C5 -3.5,5.5; C6 -2.5,5.5; C7 -1.5,5.5; C8 -0.5,5.5; C9 0.5,5.5; C10 1.5,5.5; C11 2.5,5.5; C12 3.5,5.5; C13 4.5,5.5; C14 5.5,5.5; C15 6.5,5.5; C16 7.5,5.5; D1 -7.5,4.5; D2 -6.5,4.5; D3 -5.5,4.5; D4 -4.5,4.5; D5 -3.5,4.5; D6 -2.5,4.5; D7 -1.5,4.5; D8 -0.5,4.5; D9 0.5,4.5; D10 1.5,4.5; D11 2.5,4.5; D12 3.5,4.5; D13 4.5,4.5; D14 5.5,4.5; D15 6.5,4.5; D16 7.5,4.5; E1 -7.5,3.5; E2 -6.5,3.5; E3 -5.5,3.5; E4 -4.5,3.5; E5 -3.5,3.5; E6 -2.5,3.5; E7 -1.5,3.5; E8 -0.5,3.5; E9 0.5,3.5; E10 1.5,3.5; E11 2.5,3.5; E12 3.5,3.5; E13 4.5,3.5; E14 5.5,3.5; E15 6.5,3.5; E16 7.5,3.5; F1 -7.5,2.5; F2 -6.5,2.5; F3 -5.5,2.5; F4 -4.5,2.5; F5 -3.5,2.5; F6 -2.5,2.5; F7 -1.5,2.5; F8 -0.5,2.5; F9 0.5,2.5; F10 1.5,2.5; F11 2.5,2.5; F12 3.5,2.5; F13 4.5,2.5; F14 5.5,2.5; F15 6.5,2.5; F16 7.5,2.5; G1 -7.5,1.5; G2 -6.5,1.5; G3 -5.5,1.5; G4 -4.5,1.5; G5 -3.5,1.5; G6 -2.5,1.5; G7 -1.5,1.5; G8 -0.5,1.5; G9 0.5,1.5; G10 1.5,1.5; G11 2.5,1.5; G12 3.5,1.5; G13 4.5,1.5; G14 5.5,1.5; G15 6.5,1.5; G16 7.5,1.5; H1 -7.5,0.5; H2 -6.5,0.5; H3 -5.5,0.5; H4 -4.5,0.5; H5 -3.5,0.5; H6 -2.5,0.5; H7 -1.5,0.5; H8 -0.5,0.5; H9 0.5,0.5; H10 1.5,0.5; H11 2.5,0.5; H12 3.5,0.5; H13 4.5,0.5; H14 5.5,0.5; H15 6.5,0.5; H16 7.5,0.5; J1 -7.5,-0.5; J2 -6.5,-0.5; J3 -5.5,-0.5; J4 -4.5,-0.5; J5 -3.5,-0.5; J6 -2.5,-0.5; J7 -1.5,-0.5; J8 -0.5,-0.5; J9 0.5,-0.5; J10 1.5,-0.5; J11 2.5,-0.5; J12 3.5,-0.5; J13 4.5,-0.5; J14 5.5,-0.5; J15 6.5,-0.5; J16 7.5,-0.5; K1 -7.5,-1.5; K2 -6.5,-1.5; K3 -5.5,-1.5; K4 -4.5,-1.5; K5 -3.5,-1.5; K6 -2.5,-1.5; K7 -1.5,-1.5; K8 -0.5,-1.5; K9 0.5,-1.5; K10 1.5,-1.5; K11 2.5,-1.5; K12 3.5,-1.5; K13 4.5,-1.5; K14 5.5,-1.5; K15 6.5,-1.5; K16 7.5,-1.5; L1 -7.5,-2.5; L2 -6.5,-2.5; L3 -5.5,-2.5; L4 -4.5,-2.5; L5 -3.5,-2.5; L6 -2.5,-2.5; L7 -1.5,-2.5; L8 -0.5,-2.5; L9 0.5,-2.5; L10 1.5,-2.5; L11 2.5,-2.5; L12 3.5,-2.5; L13 4.5,-2.5; L14 5.5,-2.5; L15 6.5,-2.5; L16 7.5,-2.5; M1 -7.5,-3.5; M2 -6.5,-3.5; M3 -5.5,-3.5; M4 -4.5,-3.5; M5 -3.5,-3.5; M6 -2.5,-3.5; M7 -1.5,-3.5; M8 -0.5,-3.5; M9 0.5,-3.5; M10 1.5,-3.5; M11 2.5,-3.5; M12 3.5,-3.5; M13 4.5,-3.5; M14 5.5,-3.5; M15 6.5,-3.5; M16 7.5,-3.5; N1 -7.5,-4.5; N2 -6.5,-4.5; N3 -5.5,-4.5; N4 -4.5,-4.5; N5 -3.5,-4.5; N6 -2.5,-4.5; N7 -1.5,-4.5; N8 -0.5,-4.5; N9 0.5,-4.5; N10 1.5,-4.5; N11 2.5,-4.5; N12 3.5,-4.5; N13 4.5,-4.5; N14 5.5,-4.5; N15 6.5,-4.5; N16 7.5,-4.5; P1 -7.5,-5.5; P2 -6.5,-5.5; P3 -5.5,-5.5; P4 -4.5,-5.5; P5 -3.5,-5.5; P6 -2.5,-5.5; P7 -1.5,-5.5; P8 -0.5,-5.5; P9 0.5,-5.5; P10 1.5,-5.5; P11 2.5,-5.5; P12 3.5,-5.5; P13 4.5,-5.5; P14 5.5,-5.5; P15 6.5,-5.5; P16 7.5,-5.5; R1 -7.5,-6.5; R2 -6.5,-6.5; R3 -5.5,-6.5; R4 -4.5,-6.5; R5 -3.5,-6.5; R6 -2.5,-6.5; R7 -1.5,-6.5; R8 -0.5,-6.5; R9 0.5,-6.5; R10 1.5,-6.5; R11 2.5,-6.5; R12 3.5,-6.5; R13 4.5,-6.5; R14 5.5,-6.5; R15 6.5,-6.5; R16 7.5,-6.5; T1 -7.5,-7.5; T2 -6.5,-7.5; T3 -5.5,-7.5; T4 -4.5,-7.5; T5 -3.5,-7.5; T6 -2.5,-7.5; T7 -1.5,-7.5; T8 -0.5,-7.5; T9 0.5,-7.5; T10 1.5,-7.5; T11 2.5,-7.5; T12 3.5,-7.5; T13 4.5,-7.5; T14 5.5,-7.5; T15 6.5,-7.5; T16 7.5,-7.5
SOP65P640X120-16N = smd 1.475 x 0.45: 1 -2.938,2.275; 2 -2.938,1.625; 3 -2.938,0.975; 4 -2.938,0.325; 5 -2.938,-0.325; 6 -2.938,-0.975; 7 -2.938,-1.625; 8 -2.938,-2.275; 9 2.938,-2.275; 10 2.938,-1.625; 11 2.938,-0.975; 12 2.938,-0.325; 13 2.938,0.325; 14 2.938,0.975; 15 2.938,1.625; 16 2.938,2.275
SOP65P490X110-8N = smd 1.4 x 0.45: 1 -2.2,0.975; 2 -2.2,0.325; 3 -2.2,-0.325; 4 -2.2,-0.975; 5 2.2,-0.975; 6 2.2,-0.325; 7 2.2,0.325; 8 2.2,0.975
SOP65P640X120-8N = smd 1.475 x 0.45: 1 -2.938,0.975; 2 -2.938,0.325; 3 -2.938,-0.325; 4 -2.938,-0.975; 5 2.938,-0.975; 6 2.938,-0.325; 7 2.938,0.325; 8 2.938,0.975
BGA484C100P22X22_2300X2300X240 = smd 0.5 x 0.5: A1 -10.5,10.5; A2 -9.5,10.5; A3 -8.5,10.5; A4 -7.5,10.5; A5 -6.5,10.5; A6 -5.5,10.5; A7 -4.5,10.5; A8 -3.5,10.5; A9 -2.5,10.5; A10 -1.5,10.5; A11 -0.5,10.5; A12 0.5,10.5; A13 1.5,10.5; A14 2.5,10.5; A15 3.5,10.5; A16 4.5,10.5; A17 5.5,10.5; A18 6.5,10.5; A19 7.5,10.5; A20 8.5,10.5; A21 9.5,10.5; A22 10.5,10.5; AA1 -10.5,-9.5; AA2 -9.5,-9.5; AA3 -8.5,-9.5; AA4 -7.5,-9.5; AA5 -6.5,-9.5; AA6 -5.5,-9.5; AA7 -4.5,-9.5; AA8 -3.5,-9.5; AA9 -2.5,-9.5; AA10 -1.5,-9.5; AA11 -0.5,-9.5; AA12 0.5,-9.5; AA13 1.5,-9.5; AA14 2.5,-9.5; AA15 3.5,-9.5; AA16 4.5,-9.5; AA17 5.5,-9.5; AA18 6.5,-9.5; AA19 7.5,-9.5; AA20 8.5,-9.5; AA21 9.5,-9.5; AA22 10.5,-9.5; AB1 -10.5,-10.5; AB2 -9.5,-10.5; AB3 -8.5,-10.5; AB4 -7.5,-10.5; AB5 -6.5,-10.5; AB6 -5.5,-10.5; AB7 -4.5,-10.5; AB8 -3.5,-10.5; AB9 -2.5,-10.5; AB10 -1.5,-10.5; AB11 -0.5,-10.5; AB12 0.5,-10.5; AB13 1.5,-10.5; AB14 2.5,-10.5; AB15 3.5,-10.5; AB16 4.5,-10.5; AB17 5.5,-10.5; AB18 6.5,-10.5; AB19 7.5,-10.5; AB20 8.5,-10.5; AB21 9.5,-10.5; AB22 10.5,-10.5; B1 -10.5,9.5; B2 -9.5,9.5; B3 -8.5,9.5; B4 -7.5,9.5; B5 -6.5,9.5; B6 -5.5,9.5; B7 -4.5,9.5; B8 -3.5,9.5; B9 -2.5,9.5; B10 -1.5,9.5; B11 -0.5,9.5; B12 0.5,9.5; B13 1.5,9.5; B14 2.5,9.5; B15 3.5,9.5; B16 4.5,9.5; B17 5.5,9.5; B18 6.5,9.5; B19 7.5,9.5; B20 8.5,9.5; B21 9.5,9.5; B22 10.5,9.5; C1 -10.5,8.5; C2 -9.5,8.5; C3 -8.5,8.5; C4 -7.5,8.5; C5 -6.5,8.5; C6 -5.5,8.5; C7 -4.5,8.5; C8 -3.5,8.5; C9 -2.5,8.5; C10 -1.5,8.5; C11 -0.5,8.5; C12 0.5,8.5; C13 1.5,8.5; C14 2.5,8.5; C15 3.5,8.5; C16 4.5,8.5; C17 5.5,8.5; C18 6.5,8.5; C19 7.5,8.5; C20 8.5,8.5; C21 9.5,8.5; C22 10.5,8.5; D1 -10.5,7.5; D2 -9.5,7.5; D3 -8.5,7.5; D4 -7.5,7.5; D5 -6.5,7.5; D6 -5.5,7.5; D7 -4.5,7.5; D8 -3.5,7.5; D9 -2.5,7.5; D10 -1.5,7.5; D11 -0.5,7.5; D12 0.5,7.5; D13 1.5,7.5; D14 2.5,7.5; D15 3.5,7.5; D16 4.5,7.5; D17 5.5,7.5; D18 6.5,7.5; D19 7.5,7.5; D20 8.5,7.5; D21 9.5,7.5; D22 10.5,7.5; E1 -10.5,6.5; E2 -9.5,6.5; E3 -8.5,6.5; E4 -7.5,6.5; E5 -6.5,6.5; E6 -5.5,6.5; E7 -4.5,6.5; E8 -3.5,6.5; E9 -2.5,6.5; E10 -1.5,6.5; E11 -0.5,6.5; E12 0.5,6.5; E13 1.5,6.5; E14 2.5,6.5; E15 3.5,6.5; E16 4.5,6.5; E17 5.5,6.5; E18 6.5,6.5; E19 7.5,6.5; E20 8.5,6.5; E21 9.5,6.5; E22 10.5,6.5; F1 -10.5,5.5; F2 -9.5,5.5; F3 -8.5,5.5; F4 -7.5,5.5; F5 -6.5,5.5; F6 -5.5,5.5; F7 -4.5,5.5; F8 -3.5,5.5; F9 -2.5,5.5; F10 -1.5,5.5; F11 -0.5,5.5; F12 0.5,5.5; F13 1.5,5.5; F14 2.5,5.5; F15 3.5,5.5; F16 4.5,5.5; F17 5.5,5.5; F18 6.5,5.5; F19 7.5,5.5; F20 8.5,5.5; F21 9.5,5.5; F22 10.5,5.5; G1 -10.5,4.5; G2 -9.5,4.5; G3 -8.5,4.5; G4 -7.5,4.5; G5 -6.5,4.5; G6 -5.5,4.5; G7 -4.5,4.5; G8 -3.5,4.5; G9 -2.5,4.5; G10 -1.5,4.5; G11 -0.5,4.5; G12 0.5,4.5; G13 1.5,4.5; G14 2.5,4.5; G15 3.5,4.5; G16 4.5,4.5; G17 5.5,4.5; G18 6.5,4.5; G19 7.5,4.5; G20 8.5,4.5; G21 9.5,4.5; G22 10.5,4.5; H1 -10.5,3.5; H2 -9.5,3.5; H3 -8.5,3.5; H4 -7.5,3.5; H5 -6.5,3.5; H6 -5.5,3.5; H7 -4.5,3.5; H8 -3.5,3.5; H9 -2.5,3.5; H10 -1.5,3.5; H11 -0.5,3.5; H12 0.5,3.5; H13 1.5,3.5; H14 2.5,3.5; H15 3.5,3.5; H16 4.5,3.5; H17 5.5,3.5; H18 6.5,3.5; H19 7.5,3.5; H20 8.5,3.5; H21 9.5,3.5; H22 10.5,3.5; J1 -10.5,2.5; J2 -9.5,2.5; J3 -8.5,2.5; J4 -7.5,2.5; J5 -6.5,2.5; J6 -5.5,2.5; J7 -4.5,2.5; J8 -3.5,2.5; J9 -2.5,2.5; J10 -1.5,2.5; J11 -0.5,2.5; J12 0.5,2.5; J13 1.5,2.5; J14 2.5,2.5; J15 3.5,2.5; J16 4.5,2.5; J17 5.5,2.5; J18 6.5,2.5; J19 7.5,2.5; J20 8.5,2.5; J21 9.5,2.5; J22 10.5,2.5; K1 -10.5,1.5; K2 -9.5,1.5; K3 -8.5,1.5; K4 -7.5,1.5; K5 -6.5,1.5; K6 -5.5,1.5; K7 -4.5,1.5; K8 -3.5,1.5; K9 -2.5,1.5; K10 -1.5,1.5; K11 -0.5,1.5; K12 0.5,1.5; K13 1.5,1.5; K14 2.5,1.5; K15 3.5,1.5; K16 4.5,1.5; K17 5.5,1.5; K18 6.5,1.5; K19 7.5,1.5; K20 8.5,1.5; K21 9.5,1.5; K22 10.5,1.5; L1 -10.5,0.5; L2 -9.5,0.5; L3 -8.5,0.5; L4 -7.5,0.5; L5 -6.5,0.5; L6 -5.5,0.5; L7 -4.5,0.5; L8 -3.5,0.5; L9 -2.5,0.5; L10 -1.5,0.5; L11 -0.5,0.5; L12 0.5,0.5; L13 1.5,0.5; L14 2.5,0.5; L15 3.5,0.5; L16 4.5,0.5; L17 5.5,0.5; L18 6.5,0.5; L19 7.5,0.5; L20 8.5,0.5; L21 9.5,0.5; L22 10.5,0.5; M1 -10.5,-0.5; M2 -9.5,-0.5; M3 -8.5,-0.5; M4 -7.5,-0.5; M5 -6.5,-0.5; M6 -5.5,-0.5; M7 -4.5,-0.5; M8 -3.5,-0.5; M9 -2.5,-0.5; M10 -1.5,-0.5; M11 -0.5,-0.5; M12 0.5,-0.5; M13 1.5,-0.5; M14 2.5,-0.5; M15 3.5,-0.5; M16 4.5,-0.5; M17 5.5,-0.5; M18 6.5,-0.5; M19 7.5,-0.5; M20 8.5,-0.5; M21 9.5,-0.5; M22 10.5,-0.5; N1 -10.5,-1.5; N2 -9.5,-1.5; N3 -8.5,-1.5; N4 -7.5,-1.5; N5 -6.5,-1.5; N6 -5.5,-1.5; N7 -4.5,-1.5; N8 -3.5,-1.5; N9 -2.5,-1.5; N10 -1.5,-1.5; N11 -0.5,-1.5; N12 0.5,-1.5; N13 1.5,-1.5; N14 2.5,-1.5; N15 3.5,-1.5; N16 4.5,-1.5; N17 5.5,-1.5; N18 6.5,-1.5; N19 7.5,-1.5; N20 8.5,-1.5; N21 9.5,-1.5; N22 10.5,-1.5; P1 -10.5,-2.5; P2 -9.5,-2.5; P3 -8.5,-2.5; P4 -7.5,-2.5; P5 -6.5,-2.5; P6 -5.5,-2.5; P7 -4.5,-2.5; P8 -3.5,-2.5; P9 -2.5,-2.5; P10 -1.5,-2.5; P11 -0.5,-2.5; P12 0.5,-2.5; P13 1.5,-2.5; P14 2.5,-2.5; P15 3.5,-2.5; P16 4.5,-2.5; P17 5.5,-2.5; P18 6.5,-2.5; P19 7.5,-2.5; P20 8.5,-2.5; P21 9.5,-2.5; P22 10.5,-2.5; R1 -10.5,-3.5; R2 -9.5,-3.5; R3 -8.5,-3.5; R4 -7.5,-3.5; R5 -6.5,-3.5; R6 -5.5,-3.5; R7 -4.5,-3.5; R8 -3.5,-3.5; R9 -2.5,-3.5; R10 -1.5,-3.5; R11 -0.5,-3.5; R12 0.5,-3.5; R13 1.5,-3.5; R14 2.5,-3.5; R15 3.5,-3.5; R16 4.5,-3.5; R17 5.5,-3.5; R18 6.5,-3.5; R19 7.5,-3.5; R20 8.5,-3.5; R21 9.5,-3.5; R22 10.5,-3.5; T1 -10.5,-4.5; T2 -9.5,-4.5; T3 -8.5,-4.5; T4 -7.5,-4.5; T5 -6.5,-4.5; T6 -5.5,-4.5; T7 -4.5,-4.5; T8 -3.5,-4.5; T9 -2.5,-4.5; T10 -1.5,-4.5; T11 -0.5,-4.5; T12 0.5,-4.5; T13 1.5,-4.5; T14 2.5,-4.5; T15 3.5,-4.5; T16 4.5,-4.5; T17 5.5,-4.5; T18 6.5,-4.5; T19 7.5,-4.5; T20 8.5,-4.5; T21 9.5,-4.5; T22 10.5,-4.5; U1 -10.5,-5.5; U2 -9.5,-5.5; U3 -8.5,-5.5; U4 -7.5,-5.5; U5 -6.5,-5.5; U6 -5.5,-5.5; U7 -4.5,-5.5; U8 -3.5,-5.5; U9 -2.5,-5.5; U10 -1.5,-5.5; U11 -0.5,-5.5; U12 0.5,-5.5; U13 1.5,-5.5; U14 2.5,-5.5; U15 3.5,-5.5; U16 4.5,-5.5; U17 5.5,-5.5; U18 6.5,-5.5; U19 7.5,-5.5; U20 8.5,-5.5; U21 9.5,-5.5; U22 10.5,-5.5; V1 -10.5,-6.5; V2 -9.5,-6.5; V3 -8.5,-6.5; V4 -7.5,-6.5; V5 -6.5,-6.5; V6 -5.5,-6.5; V7 -4.5,-6.5; V8 -3.5,-6.5; V9 -2.5,-6.5; V10 -1.5,-6.5; V11 -0.5,-6.5; V12 0.5,-6.5; V13 1.5,-6.5; V14 2.5,-6.5; V15 3.5,-6.5; V16 4.5,-6.5; V17 5.5,-6.5; V18 6.5,-6.5; V19 7.5,-6.5; V20 8.5,-6.5; V21 9.5,-6.5; V22 10.5,-6.5; W1 -10.5,-7.5; W2 -9.5,-7.5; W3 -8.5,-7.5; W4 -7.5,-7.5; W5 -6.5,-7.5; W6 -5.5,-7.5; W7 -4.5,-7.5; W8 -3.5,-7.5; W9 -2.5,-7.5; W10 -1.5,-7.5; W11 -0.5,-7.5; W12 0.5,-7.5; W13 1.5,-7.5; W14 2.5,-7.5; W15 3.5,-7.5; W16 4.5,-7.5; W17 5.5,-7.5; W18 6.5,-7.5; W19 7.5,-7.5; W20 8.5,-7.5; W21 9.5,-7.5; W22 10.5,-7.5; Y1 -10.5,-8.5; Y2 -9.5,-8.5; Y3 -8.5,-8.5; Y4 -7.5,-8.5; Y5 -6.5,-8.5; Y6 -5.5,-8.5; Y7 -4.5,-8.5; Y8 -3.5,-8.5; Y9 -2.5,-8.5; Y10 -1.5,-8.5; Y11 -0.5,-8.5; Y12 0.5,-8.5; Y13 1.5,-8.5; Y14 2.5,-8.5; Y15 3.5,-8.5; Y16 4.5,-8.5; Y17 5.5,-8.5; Y18 6.5,-8.5; Y19 7.5,-8.5; Y20 8.5,-8.5; Y21 9.5,-8.5; Y22 10.5,-8.5
SOIC127P600X175-8N = smd 1.5 x 0.7: 1 -2.7,1.905; 2 -2.7,0.635; 3 -2.7,-0.635; 4 -2.7,-1.905; 5 2.7,-1.905; 6 2.7,-0.635; 7 2.7,0.635; 8 2.7,1.905
QFN50P300X300X100-17N = smd 0.8 x 0.3: 1 -1.5,0.75; 2 -1.5,0.25; 3 -1.5,-0.25; 4 -1.5,-0.75; 9 1.5,-0.75; 10 1.5,-0.25; 11 1.5,0.25; 12 1.5,0.75 | smd 0.3 x 0.8: 5 -0.75,-1.5; 6 -0.25,-1.5; 7 0.25,-1.5; 8 0.75,-1.5; 13 0.75,1.5; 14 0.25,1.5; 15 -0.25,1.5; 16 -0.75,1.5 | smd 1.75 x 1.75: 17 0,0
QFN48_8MM = smd 1 x 0.23: 1 -3.9,2.75; 2 -3.9,2.25; 3 -3.9,1.75; 4 -3.9,1.25; 5 -3.9,0.75; 6 -3.9,0.25; 7 -3.9,-0.25; 8 -3.9,-0.75; 9 -3.9,-1.25; 10 -3.9,-1.75; 11 -3.9,-2.25; 12 -3.9,-2.75; 25 3.9,-2.75; 26 3.9,-2.25; 27 3.9,-1.75; 28 3.9,-1.25; 29 3.9,-0.75; 30 3.9,-0.25; 31 3.9,0.25; 32 3.9,0.75; 33 3.9,1.25; 34 3.9,1.75; 35 3.9,2.25; 36 3.9,2.75 | smd 0.23 x 1: 13 -2.75,-3.9; 14 -2.25,-3.9; 15 -1.75,-3.9; 16 -1.25,-3.9; 17 -0.75,-3.9; 18 -0.25,-3.9; 19 0.2,-3.9; 20 0.75,-3.9; 21 1.25,-3.9; 22 1.75,-3.9; 23 2.25,-3.9; 24 2.75,-3.9; 37 2.75,3.9; 38 2.25,3.9; 39 1.75,3.9; 40 1.25,3.9; 41 0.75,3.9; 42 0.25,3.9; 43 -0.25,3.9; 44 -0.75,3.9; 45 -1.25,3.9; 46 -1.75,3.9; 47 -2.25,3.9; 48 -2.75,3.9 | smd 6 x 6: THERMAL 0,0
SOT23-6 = smd 0.6 x 0.9: 1 -0.95,-1.15; 2 0,-1.15; 3 0.95,-1.15; 4 0.95,1.15; 5 0,1.15; 6 -0.95,1.15
SOT95P280X145-5N = smd 1.2 x 0.6: 1 -1.25,0.95; 2 -1.25,0; 3 -1.25,-0.95; 4 1.25,-0.95; 5 1.25,0.95
LMH5401IRMSR = smd 0.7 x 0.25: 1 -1.1,0.5 | smd 0.6 x 0.25: 2 -1.15,0; 3 -1.15,-0.5; 8 1.15,-0.5; 9 1.15,0; 10 1.15,0.5 | smd 0.25 x 0.6: 4 -0.75,-1.15; 5 -0.25,-1.15; 6 0.25,-1.15; 7 0.75,-1.15; 11 0.75,1.15; 12 0.25,1.15; 13 -0.25,1.15; 14 -0.75,1.15
LMH6401IRMZR = smd 0.8 x 0.25: 1 -1.3,0.7 | smd 0.6 x 0.25: 2 -1.4,0.2; 3 -1.4,-0.3; 4 -1.4,-0.8; 9 1.4,-0.8; 10 1.4,-0.3; 11 1.4,0.2; 12 1.4,0.7 | smd 0.25 x 0.6: 5 -0.75,-1.45; 6 -0.25,-1.45; 7 0.25,-1.45; 8 0.75,-1.45; 13 0.75,1.35; 14 0.25,1.35; 15 -0.25,1.35; 16 -0.75,1.35 | smd 0.25 x 0.25: 17 -1.25,1.25; 18 -1.25,-1.25; 19 1.25,-1.25; 20 1.25,1.25
SOP50P490X110-10N = smd 1.4 x 0.3: 1 -2.2,1; 2 -2.2,0.5; 3 -2.2,0; 4 -2.2,-0.5; 5 -2.2,-1; 6 2.2,-1; 7 2.2,-0.5; 8 2.2,0; 9 2.2,0.5; 10 2.2,1
USB-2.0-A-THT-RA-TE_AMP-292303-1 = drill 0.92: P$1 -3.5,2.71; P$2 -1,2.71; P$3 1,2.71; P$4 3.5,2.71 | drill 2.3: S$1 -6.57,0; S$2 6.57,0
H2-2.54 = drill 0.889 pad 1.651 square: 1 0,1.27 | drill 0.889 pad 1.651: 2 0,-1.27
1X08 = drill 1.016 pad 1.88: 1 0,0; 2 2.54,0; 3 5.08,0; 4 7.62,0; 5 10.16,0; 6 12.7,0; 7 15.24,0; 8 17.78,0
1X02 = drill 1.016 pad 1.88: 1 0,0; 2 2.54,0
2X5-SHROUDED = drill 1.016 pad 1.88: 1 -1.27,5.08; 2 1.27,5.08; 3 -1.27,2.54; 4 1.27,2.54; 5 -1.27,0; 6 1.27,0; 7 -1.27,-2.54; 8 1.27,-2.54; 9 -1.27,-5.08; 10 1.27,-5.08
G6K2FRFTTR03DC5 = smd 0.8 x 4.8: 1 -5.4,-3; 2 -2.2,-3; 3 0,-3; 4 2.2,-3; 5 2.2,3; 6 0,3; 7 -2.2,3; 8 -5.4,3; MP2 -3.3,-3; MP3 -1.1,-3; MP4 1.1,-3; MP7 1.1,3; MP8 -1.1,3; MP9 -3.3,3 | smd 1.15 x 4.8: MP1 -6.75,-3; MP5 3.55,-3; MP6 3.55,3; MP10 -6.75,3
TLP3475TPF = smd 0.55 x 1: 1 -0.4,-0.875; 2 0.4,-0.875; 3 0.4,0.875; 4 -0.4,0.875
CDRH125 = smd 5.4 x 4: 1 0,4.9; 2 0,-4.9
CHIP-LED0603 = smd 0.8 x 0.8: A 0,-0.75; C 0,0.75
SOIC127P600X170-9N = smd 1.525 x 0.65: 1 -2.712,1.905; 2 -2.712,0.635; 3 -2.712,-0.635; 4 -2.712,-1.905; 5 2.712,-1.905; 6 2.712,-0.635; 7 2.712,0.635; 8 2.712,1.905 | smd 2.6 x 3.1: 9 0,0
SOT-23 = smd 1.016 x 1.143: 1 -0.889,-1.016; 2 0.889,-1.016; 3 0,1.016
R0201 = smd 0.28 x 0.43: 1 -0.255,0; 2 0.255,0
RES-0402 = smd 0.5 x 0.6: P$1 -0.5,0; P$2 0.5,0
R0402 = smd 0.5 x 0.6: P$1 -0.483,0; P$2 0.483,0
0402_RES = smd 0.536 x 0.546: 1 -0.433,0; 2 0.433,0
R0603 = smd 0.889 x 0.889: 1 0,0.762; 2 0,-0.762
SW4-SMD-5.2X5.2X1.5MM = smd 1 x 0.7: 1 -3,1.85; 2 3,1.85; 3 -3,-1.85; 4 3,-1.85
LED_WS2812-2020 = smd 0.7 x 0.7: 1 0.915,-0.55; 2 0.915,0.55; 3 -0.915,0.55; 4 -0.915,-0.55
QFN50P500X500X100-33V2N = smd 0.9 x 0.3: 1 -2.45,1.75; 2 -2.45,1.25; 3 -2.45,0.75; 4 -2.45,0.25; 5 -2.45,-0.25; 6 -2.45,-0.75; 7 -2.45,-1.25; 8 -2.45,-1.75; 17 2.45,-1.75; 18 2.45,-1.25; 19 2.45,-0.75; 20 2.45,-0.25; 21 2.45,0.25; 22 2.45,0.75; 23 2.45,1.25; 24 2.45,1.75 | smd 0.3 x 0.9: 9 -1.75,-2.45; 10 -1.25,-2.45; 11 -0.75,-2.45; 12 -0.25,-2.45; 13 0.25,-2.45; 14 0.75,-2.45; 15 1.25,-2.45; 16 1.75,-2.45; 25 1.75,2.45; 26 1.25,2.45; 27 0.75,2.45; 28 0.25,2.45; 29 -0.25,2.45; 30 -0.75,2.45; 31 -1.25,2.45; 32 -1.75,2.45 | drill 0.33: PAD@1_1 -1,1; PAD@1_2 -1,0; PAD@1_3 -1,-1; PAD@2_1 0,1; PAD@2_2 0,0; PAD@2_3 0,-1; PAD@3_1 1,1; PAD@3_2 1,0; PAD@3_3 1,-1
7259962 = drill 1.3 pad 1.95: 1 -5.893,0; 2 -0.893,0
RJ45_THT_RA_AMPH-FRJAE448 = drill 0.89: P$1 -4.445,6.35; P$2 -3.175,8.89; P$3 -1.905,6.35; P$4 -0.635,8.89; P$5 0.635,6.35; P$6 1.905,8.89; P$7 3.175,6.35; P$8 4.445,8.89 | drill 1.575: S$1 -7.493,-3.048; S$2 7.493,-3.048; S$3 7.493,3.048; S$4 -7.493,3.048 | hole 3.454: -5.715,0; 5.715,0
USB_C_CUSB31-CFM2AX-01-X = smd 0.575 x 1.15: A1B12 -3.2,3.545; A4B9 -2.4,3.545; B1A12 3.2,3.545; B4A9 2.4,3.545 | smd 0.275 x 1.15: A5 -1.25,3.545; A6 -0.25,3.545; A7 0.25,3.545; A8 1.25,3.545; B5 1.75,3.545; B6 0.75,3.545; B7 -0.75,3.545; B8 -1.75,3.545 | drill 0.6 pad 1 long: M1 -4.32,2.97; M2 4.32,2.97; M3 -4.32,-2.988; M4 4.32,-2.988 | hole 0.65: 3.22,2.32; -3.23,2.31
OSCILLATOR-SMD-5X3.2 = smd 1.397 x 1.194: 1 -1.27,-1.1; 2 1.27,-1.1; 3 1.27,1.1; 4 -1.27,1.1
CRYSTAL-SMD-5X3 = smd 1.9 x 1.1: 1 -1.85,-1.15; 2 1.85,-1.15; 3 1.85,1.15; 4 -1.85,1.15

## Placement (x,y rotation side)
1KHZOUT50  50  [SMA_EDGELAUNCH]  224,146.5 180 top
BNCIN1  MOLEX_BNC_73100-0105  [MOLEX-BNC-73100-0105]  8.5,133.4 270 top
BNCIN2  MOLEX_BNC_73100-0105  [MOLEX-BNC-73100-0105]  8.5,40.4 270 top
C1  47nF  [RESC0402_N]  58.9,78.8 180 top
C2  47nF  [RESC0402_N]  58.9,80.1 0 top
C3  0.1uF  [RESC0402_N]  98,102 0 top
C4  0.1uF  [RESC0402_N]  92,102 0 top
C5  NFM31PC276B0J3L  [NFM31HK103R1H3L]  133.5,113.5 180 top
C6  10uF  [RESC0805_N]  141.5,114.5 270 top
C7  0.1uF  [RESC0402_N]  138.5,114.5 270 top
C8  10uF  [RESC0805_N]  128.5,114.5 270 top
C9  0.1uF  [RESC0402_N]  125.5,114.5 270 top
C10  10uF  [RESC0805_N]  83.15,98.6 270 top
C11  1uF  [RESC0402_N]  80,80 0 bottom
C12  0.1uF  [RESC0402_N]  80,78.9 0 bottom
C13  10uF  [RESC0805_N]  61.4,93 0 top
C14  1uF  [RESC0402_N]  73,80.1 0 bottom
C15  NFM31PC276B0J3L  [NFM31HK103R1H3L]  133.5,120 180 top
C16  10uF  [RESC0805_N]  141.5,121 270 top
C17  0.1uF  [RESC0402_N]  138.5,121 270 top
C18  10uF  [RESC0805_N]  128.5,121 270 top
C19  0.1uF  [RESC0402_N]  125.5,121 270 top
C20  0.1uF  [RESC0402_N]  73,79 0 bottom
C21  10uF  [RESC0805_N]  61.4,89 0 top
C22  1uF  [RESC0402_N]  73,83.05 0 bottom
C23  0.1uF  [RESC0402_N]  69,82 180 bottom
C24  10uF  [RESC0805_N]  79.15,98.6 270 top
C25  NFM31PC276B0J3L  [NFM31HK103R1H3L]  133.5,126 180 top
C26  10uF  [RESC0805_N]  141.5,127 270 top
C27  0.1uF  [RESC0402_N]  138.5,127 270 top
C28  10uF  [RESC0805_N]  128.5,127 270 top
C29  0.1uF  [RESC0402_N]  125.5,127 270 top
C30  1uF  [RESC0402_N]  74,77.05 180 bottom
C31  0.1uF  [RESC0402_N]  74,81.95 180 bottom
C32  1uF  [RESC0402_N]  73,75.95 0 bottom
C33  0.1uF  [RESC0402_N]  69,77 180 bottom
C34  10uF  [RESC0805_N]  122.5,108.5 270 top
C35  NFM31PC276B0J3L  [NFM31HK103R1H3L]  133.5,139 180 top
C36  10uF  [RESC0805_N]  141.5,140 270 top
C37  0.1uF  [RESC0402_N]  138.5,140 270 top
C38  10uF  [RESC0805_N]  128.5,140 270 top
C39  0.1uF  [RESC0402_N]  125.5,140 270 top
C40  10uF  [RESC0805_N]  143,92 270 top
C41  10uF  [RESC0805_N]  117.5,108.5 270 top
C42  10uF  [RESC0805_N]  138.5,92 270 top
C43  10uF  [RESC0805_N]  147.5,92 270 top
C44  0.1uF  [0402_CAP]  110.5,105 0 top
C45  NFM31PC276B0J3L  [NFM31HK103R1H3L]  133.5,132.5 180 top
C46  10uF  [RESC0805_N]  141.5,133.5 270 top
C47  0.1uF  [RESC0402_N]  138.5,133.5 270 top
C48  10uF  [RESC0805_N]  128.5,133.5 270 top
C49  0.1uF  [RESC0402_N]  125.5,133.5 270 top
C50  0.1uF  [0402_CAP]  113.5,102 270 top
C51  0.1uF  [C0402]  21.5,81.5 90 top
C52  10uF  [RESC0805_N]  141,101 90 top
C53  0.1uF  [RESC0402_N]  150.5,103 180 top
C54  0.1uF  [RESC0402_N]  153,103 0 top
C55  0.1uF  [C0402]  23.4,124.3 0 top
C56  0.1uF  [C0402]  23.4,122.7 0 top
C57  ?10?  [C0805]  14,126.5 0 top
C58  0.1uF  [RESC0402_N]  108.8,151.44 0 top
C59  0.1uF  [RESC0402_N]  135.14,78.48 180 top
C60  0.1uF  [RESC0402_N]  132.5,11 0 top
C61  0.1uF  [RESC0402_N]  120,77 0 bottom
C62  0.1uF  [RESC0402_N]  104,75 180 bottom
C63  0.1uF  [RESC0402_N]  120,86 0 bottom
C64  0.1uF  [RESC0402_N]  122.5,89.5 270 bottom
C65  0.1uF  [RESC0402_N]  122.5,69.5 90 bottom
C66  0.1uF  [RESC0402_N]  104,85.9 180 bottom
C67  0.1uF  [RESC0402_N]  101.5,69.2 90 bottom
C68  0.1uF  [RESC0402_N]  101.5,89.5 270 bottom
C69  0.1uF  [RESC0402_N]  114.5,76.5 90 bottom
C70  0.1uF  [RESC0402_N]  106.5,85.35 270 bottom
C71  0.1uF  [RESC0402_N]  118,73 0 bottom
C72  RF_1uF  [C0402]  58.3,130.6 0 top
C73  0.1uF  [RESC0402_N]  161.5,30 270 top
C74  0.1uF  [RESC0402_N]  134,149 270 top
C75  0.1uF  [C0402]  40.7,26.8 0 top
C76  10uF  [RESC0805_N]  128.5,149.5 90 top
C77  0.1uF  [RESC0402_N]  140,148.5 270 top
C78  0.1uF  [C0402]  40.7,25.2 0 top
C79  ?10?  [C0805]  30.5,25.7 0 top
C80  16pF  [C0402]  20,25 270 top
C81  22uF  [RESC0805_N]  188,91.5 0 top
C82  RF_1uF  [C0402]  62.8,34.6 0 top
C83  1000uF  [EEE0JA152UAP]  204.15,16.21 180 top
C84  0.1uF  [C0402]  67.5,41.5 180 top
C85  0.1uF  [C0402]  67.5,39.5 180 top
C86  0.1uF  [C0402]  75.5,41.5 0 top
C87  0.1uF  [C0402]  75.5,39.5 0 top
C88  0.1uF  [C0402]  75.5,54 0 top
C89  0.1uF  [C0402]  75.5,52.3 0 top
C90  0.1uF  [C0402]  67.5,54 180 top
C91  0.1uF  [C0402]  67.5,52 180 top
C92  0.1uF  [C0402]  86,48 270 top
C93  0.1uF  [C0402]  88.5,51 90 top
C94  0.1uF  [C0402]  76.3,33 270 top
C95  0.1uF  [C0402]  80.65,33 270 top
C96  0.1uF  [C0402]  77,20.5 180 top
C97  0.1uF  [C0402]  83,26.5 0 top
C98  0.1uF  [C0402]  40,102 180 top
C99  1000uF  [EEE0JA152UAP]  154.15,37.25 180 top
C100  1000uF  [EEE0JA152UAP]  154.91,142.69 180 top
C101  0.1uF  [RESC0402_N]  2.64,56.01 180 top
C102  0.1uF  [RESC0402_N]  2.72,148.99 180 top
C105  1.0pF  [C0402]  14.3,33.9 180 top
C106  1.3pF  [C0402]  14.3,29.9 180 top
C107  0.1uF  [C0402]  74.5,115 0 top
C108  0.1uF  [C0402]  74.5,117 0 top
C109  0.1uF  [C0402]  66.5,115 180 top
C110  0.1uF  [C0402]  66.5,117 180 top
C111  0.1uF  [C0402]  66.78,102.64 180 top
C112  0.1uF  [C0402]  66.78,104.34 180 top
C113  0.1uF  [C0402]  74.78,102.64 0 top
C114  0.1uF  [RESC0402_N]  145.06,70.35 90 top
C115  0.1uF  [RESC0402_N]  143.52,72.35 90 top
C116  0.1uF  [RESC0402_N]  154.07,80.95 90 top
C117  0.1uF  [RESC0402_N]  147.4,70.37 90 top
C118  10uF  [RESC0805_N]  210.42,83.83 270 top
C119  0.1uF  [RESC0402_N]  146.25,70.35 90 top
C120  10uF  [RESC0805_N]  155.33,83.39 180 top
C121  0.1uF  [RESC0402_N]  154.44,70.45 270 top
C122  0.1uF  [RESC0402_N]  146.65,83.32 180 top
C123  0.1uF  [RESC0402_N]  155.78,80.95 90 top
C124  0.1uF  [RESC0402_N]  152.14,70.45 90 top
C125  0.1uF  [RESC0402_N]  152.1,67.55 270 top
C126  10uF  [RESC0805_N]  207.21,84.96 180 top
C127  16pF  [RESC0402_N]  161.5,71 90 top
C128  16pF  [RESC0402_N]  161.5,73.6 90 top
C129  0.1uF  [C0402]  74.78,104.64 0 top
C130  0.1uF  [C0402]  56,108.5 90 top
C131  0.1uF  [C0402]  53.5,105.5 270 top
C132  0.1uF  [C0402]  61,122.7 180 top
C133  0.1uF  [C0402]  61.1,118.3 180 top
C134  0.1uF  [C0402]  47.5,113 180 top
C135  0.1uF  [C0402]  53.5,119 0 top
C136  0.75pF  [C0402]  14.3,25.9 180 top
C137  ?0?  [C0402]  14.3,21.9 180 top
C138  7.5pF  [C0402]  48.1,26.8 270 top
C139  11pF  [C0402]  52.1,26.8 270 top
C140  6.8pF  [C0402]  56.1,26.8 270 top
C141  ?0?  [C0402]  60.1,26.8 270 top
C142  0.1uF  [C0402]  30.5,80 0 top
C143  0.1uF  [C0402]  39.5,84 90 top
C144  0.1uF  [C0402]  30.5,84 180 top
C145  0.1uF  [C0402]  30.5,86 0 top
C146  0.1uF  [C0402]  37.5,84 270 top
C147  0.1uF  [C0402]  41.5,76 180 top
C148  0.1uF  [C0402]  37.5,74 90 top
C149  0.1uF  [C0402]  30.5,77 180 top
C150  0.1uF  [C0402]  47.5,86 90 top
C151  0.1uF  [C0402]  46.5,80 180 top
C152  0.1uF  [C0402]  46.5,78.5 180 top
C153  3.0pF  [C0402]  38.6,144.8 270 top
C154  0.1uF  [C0402]  24.5,79 180 top
C155  2.7nF  [C0402]  37.5,91 270 top
C156  680pF  [C0402]  33.5,91 90 top
C157  47nF  [C0402]  37.5,94 270 top
C158  3.9pF  [C0402]  42.6,144.8 270 top
C159  2.4pF  [C0402]  46.6,144.8 270 top
C160  ?0?  [C0402]  50.6,144.8 270 top
C161  7.5pF  [C0402]  38.6,124.8 270 top
C162  11pF  [C0402]  42.6,124.8 270 top
C163  6.8pF  [C0402]  46.6,124.8 270 top
C164  ?0?  [C0402]  50.6,124.8 270 top
C165  1000uF  [EEE0JA152UAP]  155.01,127.42 180 top
C166  22uF  [RESC0805_N]  157,92.5 180 top
C167  1000uF  [EEE0JA152UAP]  162.57,100.94 270 top
C168  1000uF  [EEE0JA152UAP]  160.26,52.83 180 top
C170  10uF  [RESC0805_N]  189.98,21.62 180 top
C171  1000uF  [EEE0JA152UAP]  180.33,87.3 270 top
C172  1000uF  [EEE0JA152UAP]  171.59,66.9 270 top
C173  10uF  [RESC0805_N]  190,35.82 180 top
C174  10uF  [RESC0805_N]  190.91,110.76 180 top
C175  10uF  [RESC0805_N]  191,126 180 top
C176  10uF  [RESC0805_N]  191,141 180 top
C242  10uF  [RESC0805_N]  213.1,111.82 90 top
C243  10uF  [RESC0805_N]  216.2,111.7 270 top
C244  10uF  [RESC0805_N]  153,150.14 270 top
C245  0.1uF  [RESC0402_N]  150.46,150.14 270 top
C246  10uF  [RESC0805_N]  153,119.66 270 top
C247  0.1uF  [RESC0402_N]  150.46,119.66 270 top
C248  10uF  [RESC0805_N]  153,134.9 270 top
C249  0.1uF  [RESC0402_N]  150.46,134.9 270 top
C250  0.1uF  [RESC0402_N]  150.73,20.29 180 top
C251  10uF  [RESC0805_N]  150.73,17.11 270 top
C252  0.1uF  [RESC0402_N]  157.84,18.26 270 top
C253  10uF  [RESC0805_N]  151.93,29.74 270 top
C254  0.1uF  [RESC0402_N]  149.39,29.74 270 top
C255  10uF  [RESC0805_N]  153,109.5 270 top
C256  0.1uF  [RESC0402_N]  150.46,109.5 270 top
C257  10uF  [RESC0805_N]  152,44.57 270 top
C258  0.1uF  [RESC0402_N]  149.46,44.57 270 top
C259  0.1uF  [RESC0402_N]  191.2,143.14 180 top
C260  0.1uF  [RESC0402_N]  190.3,153.7 0 top
C261  1uF  [RESC0402_N]  193.3,153.7 0 top
C262  0.1uF  [RESC0402_N]  165.3,150.7 270 top
C263  0.1uF  [RESC0402_N]  190.98,128.02 180 top
C264  0.1uF  [RESC0402_N]  190.3,138.7 0 top
C265  1uF  [RESC0402_N]  193.3,138.7 0 top
C266  0.1uF  [RESC0402_N]  165.3,135.7 270 top
C267  0.1uF  [RESC0402_N]  191.03,112.94 180 top
C268  0.1uF  [RESC0402_N]  190.3,123.7 0 top
C269  1uF  [RESC0402_N]  193.3,123.7 0 top
C270  0.1uF  [RESC0402_N]  165.3,120.7 270 top
C271  0.1uF  [RESC0402_N]  190.16,37.65 180 top
C272  0.1uF  [RESC0402_N]  189.3,48.2 0 top
C273  1uF  [RESC0402_N]  192.3,48.2 0 top
C274  0.1uF  [RESC0402_N]  164.3,45.2 270 top
C275  0.1uF  [RESC0402_N]  189.94,23.31 180 top
C276  0.1uF  [RESC0402_N]  189.3,33.7 0 top
C277  1uF  [RESC0402_N]  192.3,33.7 0 top
C278  0.1uF  [RESC0402_N]  164.3,30.7 270 top
C279  0.1uF  [RESC0402_N]  190.04,9.43 180 top
C280  0.1uF  [RESC0402_N]  189.3,19.7 0 top
C281  1uF  [RESC0402_N]  192.3,19.7 0 top
C282  0.1uF  [RESC0402_N]  164.3,16.7 270 top
C283  0.1uF  [RESC0402_N]  191.8,97.8 180 top
C284  0.1uF  [RESC0402_N]  190.2,108.2 0 top
C285  1uF  [RESC0402_N]  193.2,108.2 0 top
C286  0.1uF  [RESC0402_N]  171.2,96.1 180 top
C287  10uF  [RESC0805_N]  191.8,83.3 180 top
C288  10uF  [RESC0805_N]  190.3,7.7 180 top
C289  10uF  [RESC0805_N]  191.7,80.8 180 top
C290  22uF  [RESC0805_N]  171.2,107.2 180 top
C291  22uF  [RESC0805_N]  171.2,104.2 180 top
C292  22uF  [RESC0805_N]  171.2,101.2 180 top
C293  22uF  [RESC0805_N]  171.2,98.2 180 top
C294  22uF  [RESC0805_N]  169.3,16.7 180 top
C295  22uF  [RESC0805_N]  169.3,19.7 180 top
C296  22uF  [RESC0805_N]  169.3,13.7 180 top
C297  22uF  [RESC0805_N]  169.3,10.7 180 top
C298  22uF  [RESC0805_N]  169.3,30.7 180 top
C299  22uF  [RESC0805_N]  169.3,33.7 180 top
C300  22uF  [RESC0805_N]  169.3,27.7 180 top
C301  22uF  [RESC0805_N]  169.3,24.7 180 top
C302  22uF  [RESC0805_N]  169.3,45.2 180 top
C303  22uF  [RESC0805_N]  169.3,48.2 180 top
C304  22uF  [RESC0805_N]  169.3,42.2 180 top
C305  22uF  [RESC0805_N]  169.3,39.2 180 top
C306  22uF  [RESC0805_N]  170.3,120.7 180 top
C307  22uF  [RESC0805_N]  170.3,123.7 180 top
C308  22uF  [RESC0805_N]  170.3,117.7 180 top
C309  22uF  [RESC0805_N]  170.3,114.7 180 top
C310  22uF  [RESC0805_N]  170.3,135.7 180 top
C311  22uF  [RESC0805_N]  170.3,138.7 180 top
C312  22uF  [RESC0805_N]  170.3,132.7 180 top
C313  22uF  [RESC0805_N]  170.3,129.7 180 top
C314  22uF  [RESC0805_N]  170.3,150.7 180 top
C315  22uF  [RESC0805_N]  170.3,153.7 180 top
C316  22uF  [RESC0805_N]  170.3,147.7 180 top
C317  22uF  [RESC0805_N]  170.3,144.7 180 top
C318  0.1uF  [RESC0402_N]  189.4,97.8 180 top
C319  10uF  [RESC0805_N]  215.8,89.3 270 top
C320  10uF  [RESC0805_N]  193.9,95.79 180 top
C321  10uF  [RESC0805_N]  212.8,89.3 90 top
C322  10uF  [RESC0805_N]  189.7,95.8 180 top
CLKEXT  BU-SMB-V  [BU-SMB-V]  133.73,55.67 0 top
CLKOUT2  BU-SMB-V  [BU-SMB-V]  131,102 0 top
CN2  12Vin  [DCJACK_2MM_PTH]  226.8,101.2 90 top
D10  B340A  [SMA-DIODE]  157.87,11.37 90 top
EXTTRIGIN  50  [SMA_EDGELAUNCH]  224,13.5 180 top
FB2  50mΩ 220Ω@100MHz 0603  [0603]  207.45,82.89 180 top
FL1  OPA859IDSGR  [SON50P200X200X80-9N]  78.5,32.5 90 top
FL2  OPA859IDSGR  [SON50P200X200X80-9N]  20.5,123.7 0 top
FL3  OPA859IDSGR  [SON50P200X200X80-9N]  37.8,26.2 0 top
FL4  OPA859IDSGR  [SON50P200X200X80-9N]  61,120.5 0 top
H1  SLP3-150-100-F  [SLP3150100F]  6.3,53.4 270 top
H2  SLP3-150-100-F  [SLP3150100F]  6.3,146.4 270 top
IC1  ADC12DL2500ACF  [BGA256C100P16X16_1700X1700X331]  75,79.5 0 top
IC2  SN74AVC4T774PWR  [SOP65P640X120-16N]  95.5,105.5 180 top
IC3  ADC122S021CIMM_NOPB  [SOP65P490X110-8N]  117.5,102 0 top
IC4  TLV9102IPWR  [SOP65P640X120-8N]  108,102.5 0 top
IC5  EP4CE30F23C6N  [BGA484C100P22X22_2300X2300X240]  112,79.5 270 top
IC6  EPCQ16ASI8N  [SOIC127P600X175-8N]  110,146.5 270 top
IC7  TPS7A7200RGTR  [QFN50P300X300X100-17N]  151.5,100 0 top
IC8  FT232HQ  [QFN48_8MM]  148.66,77.41 180 top
IC9  93LC56B  [SOT23-6]  149.09,67.44 180 top
IC10  TPS72325DBVR  [SOT95P280X145-5N]  137,149 180 top
IC13  LMH5401IRMST  [LMH5401IRMSR]  71.5,40.5 0 top
IC14  LMH6401IRMZR  [LMH6401IRMZR]  71.5,53 90 top
IC15  SN74AVC4T774PWR  [SOP65P640X120-16N]  84.5,54 270 top
IC17  DAC8562SDGSR  [SOP50P490X110-10N]  45,103 0 top
IC18  TLV9102IPWR  [SOP65P640X120-8N]  80,23.5 180 top
IC21  LMH5401IRMST  [LMH5401IRMSR]  70.5,116 180 top
IC22  TPS7A7200RGTR  [QFN50P300X300X100-17N]  159.35,150.14 0 top
IC23  TPS7A7200RGTR  [QFN50P300X300X100-17N]  159.35,119.66 0 top
IC24  TPS7A7200RGTR  [QFN50P300X300X100-17N]  159.35,134.9 0 top
IC25  TPS72325DBVR  [SOT95P280X145-5N]  154.54,19.02 180 top
IC26  TPS7A7200RGTR  [QFN50P300X300X100-17N]  158.28,29.74 0 top
IC27  TPS7A7200RGTR  [QFN50P300X300X100-17N]  159.35,109.5 0 top
IC28  TPS7A7200RGTR  [QFN50P300X300X100-17N]  158.35,44.57 0 top
IC29  LMH6401IRMZR  [LMH6401IRMZR]  70.78,103.64 270 top
IC30  SN74AVC4T774PWR  [SOP65P640X120-16N]  57.5,102.5 90 top
IC33  TLV9102IPWR  [SOP65P640X120-8N]  50.5,116 180 top
J2  test1  [USB-2.0-A-THT-RA-TE_AMP-292303-1]  10.7,90.8 270 top
J3  2p-2.54  [H2-2.54]  144,100.5 0 top
J4  2p-2.54  [H2-2.54]  131.5,149.5 180 top
J11  8pin  [1X08]  113.4,16 180 top
J15  test1  [USB-2.0-A-THT-RA-TE_AMP-292303-1]  10.7,69.3 270 top
J30  2p-2.54  [H2-2.54]  216.28,94.01 270 top
J31  2p-2.54  [H2-2.54]  147.92,150.14 180 top
J32  2p-2.54  [H2-2.54]  147.92,119.66 180 top
J33  2p-2.54  [H2-2.54]  147.92,134.9 180 top
J34  2p-2.54  [H2-2.54]  146.92,17.75 0 top
J35  2p-2.54  [H2-2.54]  146.85,29.74 180 top
J36  2p-2.54  [H2-2.54]  147.92,109.5 180 top
J37  2p-2.54  [H2-2.54]  146.92,44.57 180 top
J39  2p-2.54  [H2-2.54]  165.3,145.7 0 top
J40  2p-2.54  [H2-2.54]  165.3,130.7 0 top
J41  2p-2.54  [H2-2.54]  165.3,115.7 0 top
J42  2p-2.54  [H2-2.54]  164.3,40.2 0 top
J43  2p-2.54  [H2-2.54]  164.3,25.7 0 top
J44  2p-2.54  [H2-2.54]  164.3,11.7 0 top
J45  2p-2.54  [H2-2.54]  189.2,61.7 0 top
J46  2p-2.54  [H2-2.54]  196.2,85.3 0 top
JST_FAN  Fan  [1X02]  197,62 0 top
JTAG  2x5  [2X5-SHROUDED]  215,59 0 top
K1  G6K-2F-RF-T-TR03_DC5  [G6K2FRFTTR03DC5]  22.5,34.5 270 top
K2  G6K-2F-RF-T-TR03_DC5  [G6K2FRFTTR03DC5]  38,34.5 270 top
K3  G6K-2F-RF-T-TR03_DC5  [G6K2FRFTTR03DC5]  53.5,34.5 270 top
K4  G6K-2F-RF-T-TR03_DC5  [G6K2FRFTTR03DC5]  24,133.5 270 top
K5  G6K-2F-RF-T-TR03_DC5  [G6K2FRFTTR03DC5]  44.5,133.5 270 top
K6  TLP3475_TP,F  [TLP3475TPF]  58.21,133.95 180 top
K7  TLP3475_TP,F  [TLP3475TPF]  62.77,37.83 180 top
L1  10uH  [CDRH125]  181.3,148.7 270 top
L2  10uH  [CDRH125]  166,88 270 top
L4  3.3nH  [RESC0402_N]  14.8,31.9 270 top
L7  3.3nH  [RESC0402_N]  14.9,27.9 270 top
L8  15nH  [RESC0402_N]  50.1,27.3 0 top
L9  10uH  [CDRH125]  181.3,133.7 270 top
L10  10uH  [CDRH125]  181.3,118.7 270 top
L11  10uH  [CDRH125]  180.3,43.2 270 top
L12  10uH  [CDRH125]  180.3,28.7 270 top
L13  10uH  [CDRH125]  180.3,14.7 270 top
L14  10uH  [CDRH125]  181.2,103.2 270 top
L15  15nH  [RESC0402_N]  54.1,27.4 0 top
L16  6.8nH  [RESC0402_N]  40.6,145.3 0 top
L17  6.8nH  [RESC0402_N]  44.6,145.4 0 top
L18  15nH  [RESC0402_N]  40.6,125.3 0 top
L19  15nH  [RESC0402_N]  44.6,125.4 0 top
LED1  red  [CHIP-LED0603]  144.5,151.5 90 top
LED2  red  [CHIP-LED0603]  219,111.5 0 top
LED3  red  [CHIP-LED0603]  199.72,89.82 90 top
LED4  red  [CHIP-LED0603]  208,90 270 top
LED25  red  [CHIP-LED0603]  113,10 180 top
LED26  red  [CHIP-LED0603]  110.5,10 180 top
LED27  red  [CHIP-LED0603]  108,10 180 top
LED28  red  [CHIP-LED0603]  105.5,10 180 top
LED29  red  [CHIP-LED0603]  103,10 180 top
LED30  red  [CHIP-LED0603]  100.5,10 180 top
LED32  red  [CHIP-LED0603]  189,54.5 0 top
LED41  red  [CHIP-LED0603]  119,15.5 180 top
LED42  red  [CHIP-LED0603]  122,15.5 180 top
LED43  red  [CHIP-LED0603]  131,92.5 270 top
LED45  red  [CHIP-LED0603]  119,10 180 top
LED46  red  [CHIP-LED0603]  122,10 180 top
LED47  red  [CHIP-LED0603]  125,10 180 top
LED48  red  [CHIP-LED0603]  128,10 180 top
OUTSPLIT  50  [SMA_EDGELAUNCH]  0.22,15.52 0 top
PS2  LMR33630ADDA  [SOIC127P600X170-9N]  192.3,147.7 90 top
PS9  LMR33630ADDA  [SOIC127P600X170-9N]  192.3,132.7 90 top
PS10  LMR33630ADDA  [SOIC127P600X170-9N]  192.3,117.7 90 top
PS11  LMR33630ADDA  [SOIC127P600X170-9N]  191.3,42.2 90 top
PS12  LMR33630ADDA  [SOIC127P600X170-9N]  191.3,27.7 90 top
PS13  LMR33630ADDA  [SOIC127P600X170-9N]  191.3,13.7 90 top
PS14  LMR33630ADDA  [SOIC127P600X170-9N]  192.2,102.2 90 top
Q1  S8050  [SOT-23]  198.5,54 270 top
Q2  FDN340P  [SOT-23]  203,84 270 top
Q4  S8050  [SOT-23]  25.35,146.7 270 top
Q5  S8050  [SOT-23]  59.55,142.95 90 top
Q7  S8050  [SOT-23]  42.3,45.8 270 top
Q8  S8050  [SOT-23]  57.9,45.8 270 top
Q9  S8050  [SOT-23]  26.7,45.9 270 top
R1  100  [R0201]  90,107.5 180 top
R2  100  [R0201]  90,106.5 180 top
R3  100  [R0201]  90,105.5 180 top
R4  100  [R0201]  90,104.5 180 top
R5  10k  [RES-0402]  90,103.5 180 top
R6  1k  [RES-0402]  26.5,76 270 top
R7  1k  [RES-0402]  26.5,82 90 top
R8  1k  [RES-0402]  35.5,46.5 90 top
R9  1k  [RES-0402]  63.5,45 0 top
R10  1k  [RES-0402]  50.5,46 90 top
R11  1k  [RES-0402]  20.3,45.75 90 top
R12  1k  [RES-0402]  18,147 90 top
R13  1k  [RES-0402]  59,138 0 top
R14  1k  [RES-0402]  60,73.5 180 top
R15  0  [RES-0402]  98.15,109.15 0 top
R16  1k  [RES-0402]  109.5,97 0 top
R17  100  [R0201]  109.65,87.5 90 bottom
R18  0  [RES-0402]  124,108.5 270 top
R19  100  [R0201]  112,85 0 bottom
R20  100  [R0201]  110,84 0 bottom
R21  100  [R0201]  108,84 0 bottom
R22  1k  [RES-0402]  63.85,144.61 0 top
R23  100  [R0201]  116.5,69.5 270 bottom
R24  100  [R0201]  119.5,69.5 270 bottom
R25  100  [R0201]  118.5,69.5 270 bottom
R26  100  [R0201]  115.5,89.5 90 bottom
R27  10k  [RES-0402]  142,72.5 90 top
R28  1k  [RES-0402]  142,70 90 top
R29  1k  [RES-0402]  142,67.5 90 top
R30  1k  [RES-0402]  190.5,54.5 270 top
R31  47  [RES-0402]  217.5,12 90 top
R32  1k  [RES-0402]  100.5,12.5 270 top
R33  1k  [RES-0402]  103,12.5 270 top
R34  1k  [RES-0402]  105.5,12.5 270 top
R35  1k  [RES-0402]  108,12.5 270 top
R36  1k  [RES-0402]  110.5,12.5 270 top
R37  1k  [RES-0402]  113,12.5 270 top
R38  10k  [RES-0402]  163.5,74 90 top
R39  100  [R0201]  105.44,85.5 90 bottom
R40  1k  [RES-0402]  163.5,71 90 top
R41  1k  [RES-0402]  163.5,68 90 top
R42  1M  [R0402]  14.5,129.5 0 top
R43  47  [R0402]  26.5,123.5 0 top
R44  39  [R0402]  72.25,46.45 90 top
R45  39  [R0402]  70.75,46.45 90 top
R46  1k  [RES-0402]  128,12.5 270 top
R47  1k  [RES-0402]  125,12.5 270 top
R48  1k  [RES-0402]  122,12.5 270 top
R49  1k  [RES-0402]  119,12.5 270 top
R50  357  [RES-0402]  5.5,150 180 top
R51  1k  [RES-0402]  128.5,92.5 0 top
R52  1k  [RES-0402]  122,18 270 top
R53  1k  [RES-0402]  119,18 270 top
R54  100  [R0201]  106.5,83.5 270 bottom
R55  100  [R0201]  111.5,89.5 90 bottom
R56  100  [R0201]  111.5,87.5 90 bottom
R57  100  [R0201]  110.5,89.5 90 bottom
R58  100  [R0201]  109.5,89.5 90 bottom
R59  100  [R0201]  108.5,89.5 90 bottom
R60  100  [R0201]  106.5,89.5 90 bottom
R61  100  [R0201]  107.5,82.5 270 bottom
R62  100  [R0201]  107.5,80.5 270 bottom
R63  100  [R0201]  115.45,69.35 270 bottom
R64  100  [R0201]  114.45,69.35 270 bottom
R65  100  [R0201]  113.4,69.4 270 bottom
R66  100  [R0201]  112.3,69.4 270 bottom
R67  100  [R0201]  111.3,69.4 270 bottom
R68  100  [R0201]  113.5,73.5 90 bottom
R69  100  [R0201]  111.5,71.5 270 bottom
R70  100  [R0201]  110.5,71.5 270 bottom
R71  100  [R0201]  110.5,73.5 90 bottom
R72  100  [R0201]  108.5,72.5 90 bottom
R73  100  [R0201]  106.5,71.5 270 bottom
R74  100  [R0201]  104,74 0 bottom
R75  100  [R0201]  107.35,76.55 270 bottom
R76  100  [R0201]  107.5,78.5 270 bottom
R77  100  [R0201]  105.5,89.5 90 bottom
R78  10k  [RES-0402]  135,11 0 top
R79  10k  [RES-0402]  111.5,151.5 180 top
R80  10k  [RES-0402]  112,60.5 270 top
R81  0  [RES-0402]  113,97 0 top
R82  10k  [RES-0402]  206.5,60.5 90 top
R83  10k  [RES-0402]  113,60.5 270 top
R84  10k  [RES-0402]  114,60.5 270 top
R85  10k  [RES-0402]  115,60.5 270 top
R86  10k  [RES-0402]  116,60.5 270 top
R87  0  [RES-0402]  144.5,92 270 top
R88  0  [RES-0402]  149,92 270 top
R89  0  [RES-0402]  140,92 270 top
R90  0  [RES-0402]  119,108.5 270 top
R91  10k  [RES-0402]  209.5,60.5 90 top
R92  10k  [RES-0402]  208,60.5 90 top
R93  1k  [RES-0402]  208,63 90 top
R94  100  [R0201]  104.5,89.5 90 bottom
R95  100  [R0201]  110.8,83.05 0 bottom
R96  100  [R0201]  104,81 0 bottom
R97  100  [R0201]  106.01,76.94 180 bottom
R98  100  [R0201]  106,76 0 bottom
R99  100  [R0201]  106.5,74.5 270 bottom
R100  100  [R0201]  103.5,89.5 90 bottom
R101  100  [R0201]  102,86 0 bottom
R102  100  [R0201]  103.95,83.99 0 bottom
R103  100  [R0201]  102,84 0 bottom
R104  100  [R0201]  102,83 0 bottom
R105  100  [R0201]  102,82 0 bottom
R106  100  [R0201]  102,81 0 bottom
R107  100  [R0201]  110.5,69.5 270 bottom
R108  100  [R0201]  109.5,69.5 270 bottom
R109  100  [R0201]  108.5,69.5 270 bottom
R110  100  [R0201]  106.5,69.5 270 bottom
R111  100  [R0201]  105.5,69.5 270 bottom
R112  100  [R0201]  103.5,69.5 270 bottom
R113  100  [R0201]  104.5,69.5 270 bottom
R114  100  [R0201]  102,71.2 0 bottom
R115  100  [R0201]  102,74 0 bottom
R116  100  [R0201]  102,75 0 bottom
R117  100  [R0201]  102,76 0 bottom
R118  100  [R0201]  102,76.97 0 bottom
R119  100  [R0201]  102,78 0 bottom
R120  100  [R0201]  104,78 0 bottom
R121  10k  [RES-0402]  142,80 180 top
R122  1k  [0402_RES]  103,107.5 270 top
R123  10k  [RES-0402]  142.5,76 270 top
R124  1k  [0402_RES]  103,101.5 90 top
R125  10k  [0402_RES]  112.5,100 90 top
R126  1k  [0402_RES]  112.5,102 90 top
R127  10k  [0402_RES]  56,76 0 top
R128  0  [0402_RES]  60,74.5 180 top
R129  0  [0402_RES]  105,105 0 top
R130  10k  [0402_RES]  110.5,100 180 top
R131  127  [R0402]  73,37.5 0 top
R132  127  [R0402]  70.5,37.5 180 top
R133  66.5  [R0402]  73,35.5 180 top
R134  22.6  [R0402]  71.1,35.5 90 top
R135  220  [R0402]  70.5,33.5 0 top
R136  47  [RES-0402]  217.5,10 90 top
R137  100k  [RES-0402]  195.33,26.72 0 top
R138  39  [R0402]  72,58 90 top
R139  39  [R0402]  70.5,58 90 top
R140  1k  [R0402]  21.25,147.2 270 top
R141  1k  [R0402]  63.25,142.55 90 top
R142  0  [R0402]  76.4,36.1 270 top
R143  1k  [R0402]  40,105 0 top
R144  1k  [R0402]  74,22.5 180 top
R145  1k  [R0402]  74,24 0 top
R146  1k  [R0402]  79,26.5 0 top
R147  1k  [R0402]  74,25.5 180 top
R148  10k  [RES-0402]  157,94.31 0 top
R149  0  [R0402]  48.59,145.36 180 top
R150  0  [R0402]  48.59,125.36 180 top
R151  10k  [RES-0402]  198.57,103.14 180 top
R152  5.1k  [RES-0402]  201.17,103.18 180 top
R153  47  [R0402]  44.5,78 270 top
R154  47  [R0402]  44.5,80.5 90 top
R155  0  [R0402]  45.5,86 270 top
R156  10k  [R0402]  38.4,69.4 90 top
R157  1k  [RES-0402]  144.95,66.4 90 top
R158  1M  [R0402]  31,28 0 top
R159  47  [R0402]  43.5,26 0 top
R160  47  [RES-0402]  217.5,15 270 top
R161  10k  [RES-0402]  147,100.5 270 top
R162  1k  [R0402]  38.2,46.3 270 top
R163  100k  [RES-0402]  196.25,132.55 0 top
R164  1k  [R0402]  53.7,46.2 270 top
R165  5.1k  [RES-0402]  208.25,91.15 0 top
R166  0  [R0402]  58.09,27.36 180 top
R167  10k  [RES-0402]  203,94 0 top
R168  47  [R0402]  23.1,26.8 270 top
R169  47  [R0402]  21.51,26.8 270 top
R170  47  [R0402]  22.1,24.4 180 top
R171  1k  [R0402]  22.6,45.8 270 top
R172  1k  [R0402]  74,21 180 top
R173  10k  [R0402]  35.4,69.4 90 top
R174  10k  [R0402]  32.4,69.4 90 top
R175  10k  [R0402]  41.4,69.4 90 top
R176  5.1k  [R0402]  34.5,85 0 top
R177  47  [R0402]  21.5,78.5 90 top
R178  1k  [R0402]  35.5,91 90 top
R179  1k  [RES-0402]  146.02,66.38 270 top
R180  1k  [R0402]  44.5,115 0 top
R181  1k  [R0402]  44.5,113.5 0 top
R182  5.1k  [RES-0402]  211.42,79.76 0 top
R183  5.1k  [RES-0402]  211.42,74.64 0 top
R184  39  [RES-0402]  142.01,78.18 180 top
R185  357  [R0402]  35.5,94 90 top
R186  10k  [0402_RES]  58,76 0 top
R187  39  [R0402]  70,110 270 top
R188  39  [R0402]  71.5,110 270 top
R189  127  [R0402]  69,119 180 top
R190  127  [R0402]  71.5,119 0 top
R191  66.5  [R0402]  69,121 0 top
R192  22.6  [R0402]  70.9,121 270 top
R193  220  [R0402]  71.5,123 180 top
R194  39  [R0402]  70,98.5 270 top
R195  39  [R0402]  71.5,98.5 270 top
R196  0  [R0402]  64.6,120.4 90 top
R197  1k  [R0402]  44.5,120 180 top
R198  10k  [0402_RES]  60,76 0 top
R199  1k  [R0402]  44.5,116.5 180 top
R200  1k  [R0402]  56,115.5 90 top
R201  1k  [R0402]  44.5,118 180 top
R202  1k  [0402_RES]  103,105.5 270 top
R203  1k  [0402_RES]  103,103.5 270 top
R204  1M  [RES-0402]  197,123 180 top
R205  1M  [RES-0402]  197,124 180 top
R206  1k  [RES-0402]  12.6,113.22 0 top
R207  NCP18WF104F03RC  [R0603]  109.5,98.5 90 top
R208  1k  [R0402]  192.5,54.5 270 top
R209  100k  [RES-0402]  195.31,15.71 180 top
R210  47  [RES-0402]  217.5,17 270 top
R211  47  [RES-0402]  135,77 0 bottom
R212  10k  [RES-0402]  196.21,99.76 180 top
R213  10k  [RES-0402]  155.54,150.14 270 top
R214  10k  [RES-0402]  155.54,119.66 270 top
R215  10k  [RES-0402]  155.54,134.9 270 top
R216  10k  [RES-0402]  154.47,29.74 270 top
R217  5.1k  [RES-0402]  220.69,111.19 90 top
R218  5.1k  [RES-0402]  144.54,150.22 180 top
R219  10k  [RES-0402]  155.54,109.5 270 top
R220  10k  [RES-0402]  154.54,44.57 270 top
R221  100k  [RES-0402]  196.3,150.7 0 top
R222  39k  [RES-0402]  196.3,148.7 180 top
R223  100k  [RES-0402]  196.3,135.7 0 top
R224  100k  [RES-0402]  196.3,133.7 180 top
R225  100k  [RES-0402]  196.3,120.7 0 top
R226  100k  [RES-0402]  196.3,118.7 180 top
R227  100k  [RES-0402]  195.3,45.2 0 top
R228  56k  [RES-0402]  195.3,43.2 180 top
R229  100k  [RES-0402]  195.3,30.7 0 top
R230  100k  [RES-0402]  195.3,28.7 180 top
R231  100k  [RES-0402]  195.3,16.7 0 top
R232  100k  [RES-0402]  195.3,14.7 180 top
R233  100k  [RES-0402]  196.2,105.2 0 top
R234  10k  [RES-0402]  196.2,103.2 180 top
R235  5.1k  [RES-0402]  199.49,90.96 180 top
R236  1k  [RES-0402]  196.21,100.76 0 top
R237  1k  [RES-0402]  202.99,92.72 180 top
R238  1k  [RES-0402]  205.1,95.41 0 top
R239  10k  [RES-0402]  205.09,94.01 0 top
R240  120  [R0402]  63.5,43.5 0 top
R241  120  [R0402]  56.5,138 0 top
R242  47  [R0402]  20,27.5 270 top
R243  1k  [RES-0402]  98,19 270 top
R244  1k  [RES-0402]  95.5,19 270 top
R246  10k  [RES-0402]  203.01,95.41 0 top
R247  0  [R0402]  14.86,23.91 90 top
SW3  SKQGADE010  [SW4-SMD-5.2X5.2X1.5MM]  120.5,147 270 top
SW4  SKQGADE010  [SW4-SMD-5.2X5.2X1.5MM]  133.5,15.5 270 top
U1  WS2812-2020  [LED_WS2812-2020]  3.5,145.2 270 top
U2  ADF4350BCPZ  [QFN50P500X500X100-33V2N]  36.5,79 90 top
U3  WS2812-2020  [LED_WS2812-2020]  3.5,52.2 270 top
U4  725996-2  [7259962]  2.2,113 180 top
U5  725996-2  [7259962]  2.2,108 180 top
U$1  RJ45-CONNECTOR-SHIELDED  [RJ45_THT_RA_AMPH-FRJAE448]  218,34 90 top
U$3  RJ45-CONNECTOR-SHIELDED  [RJ45_THT_RA_AMPH-FRJAE448]  218.1,127.2 90 top
X1  USBC  [USB_C_CUSB31-CFM2AX-01-X]  219.93,77.87 90 top
Y2  OSCILLATORSMD-5X3  [OSCILLATOR-SMD-5X3.2]  130.52,79.64 180 top
Y3  12MHz  [CRYSTAL-SMD-5X3]  158.5,72 270 top

## Tracks (layer width: path | path; a pad name or v marks a point on that pad's centre or on a via)
1KHZOUT
  top 0.152: R206.P$1 8.33,113.22 U4.2 U4.1
1KHZOUT50  (via drill 0.2)
  sig5 0.16: IC5.B15 122.09,76.59 122.67,76.59 123.08,77 R211.P$2
  other vias: 121.5,76
1MPATH
  top 0.152: FL3.4 34.55,25.45
  top 0.16: 34.55,25.45 34.1,25.45 R158.P$2 31.5,28.05 | 31.5,28.05 31.5,31.5 32.25,32.25 34.95,32.25 K2.4 | C79.2 31.45,28 31.5,28.05
1MPATH2
  top 0.152: FL2.4 17.05,122.95 16.5,123.5 | C57.2 15.05,126.6 R42.P$2
  top 0.16: 16.5,123.5 15.05,124.95 15.05,126.6 | R42.P$2 16.85,131.3 K4.4
1MPATH50
  top 0.16: R159.P$2 44.55,26.5 44.55,30.95 43.2,32.3 K2.5
1MPATH502
  top 0.16: K4.5 27.2,131.5 30.5,131.5 31,131 31,127.45 R43.P$2
1V2
  top 0.406: IC7.1 IC7.16 | IC7.16 151.05,101.8 C53.1 | IC7.16 IC7.15 | IC7.16 150.97,101.5
  top 1: R88.P$1 149,94.75 146.75,97 144,97 | R89.P$1 140,93 144,97 | 144,97 J3.2 | J3.2 142.77,99.23 142,100 141.1,100 C52.1 | 150.97,101.5 149.81,101.5 149.31,101 R161.P$1 145.77,101 J3.2
1V5  (via drill 0.35)
  top 0.305: R223.P$2 v198.3,135.7 | v179.3,135.7 177.3,133.7 L9.2 | 160.1,136.56 160.05,136.45 IC24.13 IC24.14
  top 1.27: 167.3,135.75 166.42,135.75 165.93,136.24 165.31,136.24 C266.1 162.08,136.25 161.74,136.59 160.13,136.59 160.1,136.56 | J40.1 167.3,133.97 167.3,135.75 | C313.1 C312.1 | C312.1 C310.1 C311.1 170.69,139.41 170.69,139.7 170.23,140.16 168.37,140.16 167.88,139.67 167.88,136.33 167.3,135.75 | C312.1 172.4,133.7
  top 2.54: 172.4,133.7 L9.2 171.3,138.8 171.3,139.95 170.48,140.77 168.12,140.77 167.3,139.95 167.3,133.74 165.99,132.43 165.76,132.43 J40.1 164.98,131.65 164.38,131.65 160.15,127.42 C165.1
  sig5 0.305: v198.3,135.7 197.8,135.2 197.75,135.25 179.75,135.25 v179.3,135.7
1V5D  (via drill 0.35)
  top 0.127: IC7.14 IC7.13
  top 0.305: R229.P$2 v197.3,30.7 | v178.3,30.7 176.3,28.7 176,28.7 175.5,28.7 L12.2
  top 0.406: 153,101.14 IC7.12 | IC7.13 151.76,101.5 151.97,101.71 152.06,101.71
  top 1: 152.06,101.71 152.45,102.1 C54.1 152.45,101.69 153,101.14 153.11,101.03 153.66,101.03 156.19,98.5 v156.5,98.5
  top 1.27: J43.1 166.3,28.97 166.3,30.75 165.42,30.75 164.93,31.24 164.31,31.24 C278.1 164.3,32.09 167.37,35.16 | 171.35,28.7 170.4,27.75 C300.1 | C300.1 C298.1 C299.1 169.69,34.41 169.69,34.7 169.23,35.16 167.37,35.16 | C300.1 C301.1 | 167.37,35.16 165.29,37.25 C99.1
  top 2.54: 171.35,28.7 175.5,28.7 | J43.1 164.76,27.43 164.99,27.43 166.3,28.74 166.3,34.95 167.12,35.77 | 167.12,35.77 169.48,35.77 170.3,34.95 170.3,34.4 176,28.7 | C99.1 162.84,37.25 163.38,36.71 166.19,36.71 167.12,35.77
  pow1 1: v156.5,98.5 162,93 162,29.27 J43.1
  sig5 0.305: v197.3,30.7 196.8,30.2 178.8,30.2 v178.3,30.7
1V25OUT-1
  top 0.152: IC18.7 75.38,23.18 R145.P$2 73.45,25.1 R147.P$2
1V25OUT-2
  top 0.089: 44,117.38 44,118 R201.P$2 | 44,117.38 44,116.5 | 44,117.38 48.38,117.38 48.5,117.25 48.5,116 48.25,115.75 47.62,115.75 IC33.7
  top 0.152: R199.P$2 44,116.5
2V2  (via drill 0.35)